# EAGLE board DM01eco (EAGLE 6.6.0), part 1 of 8
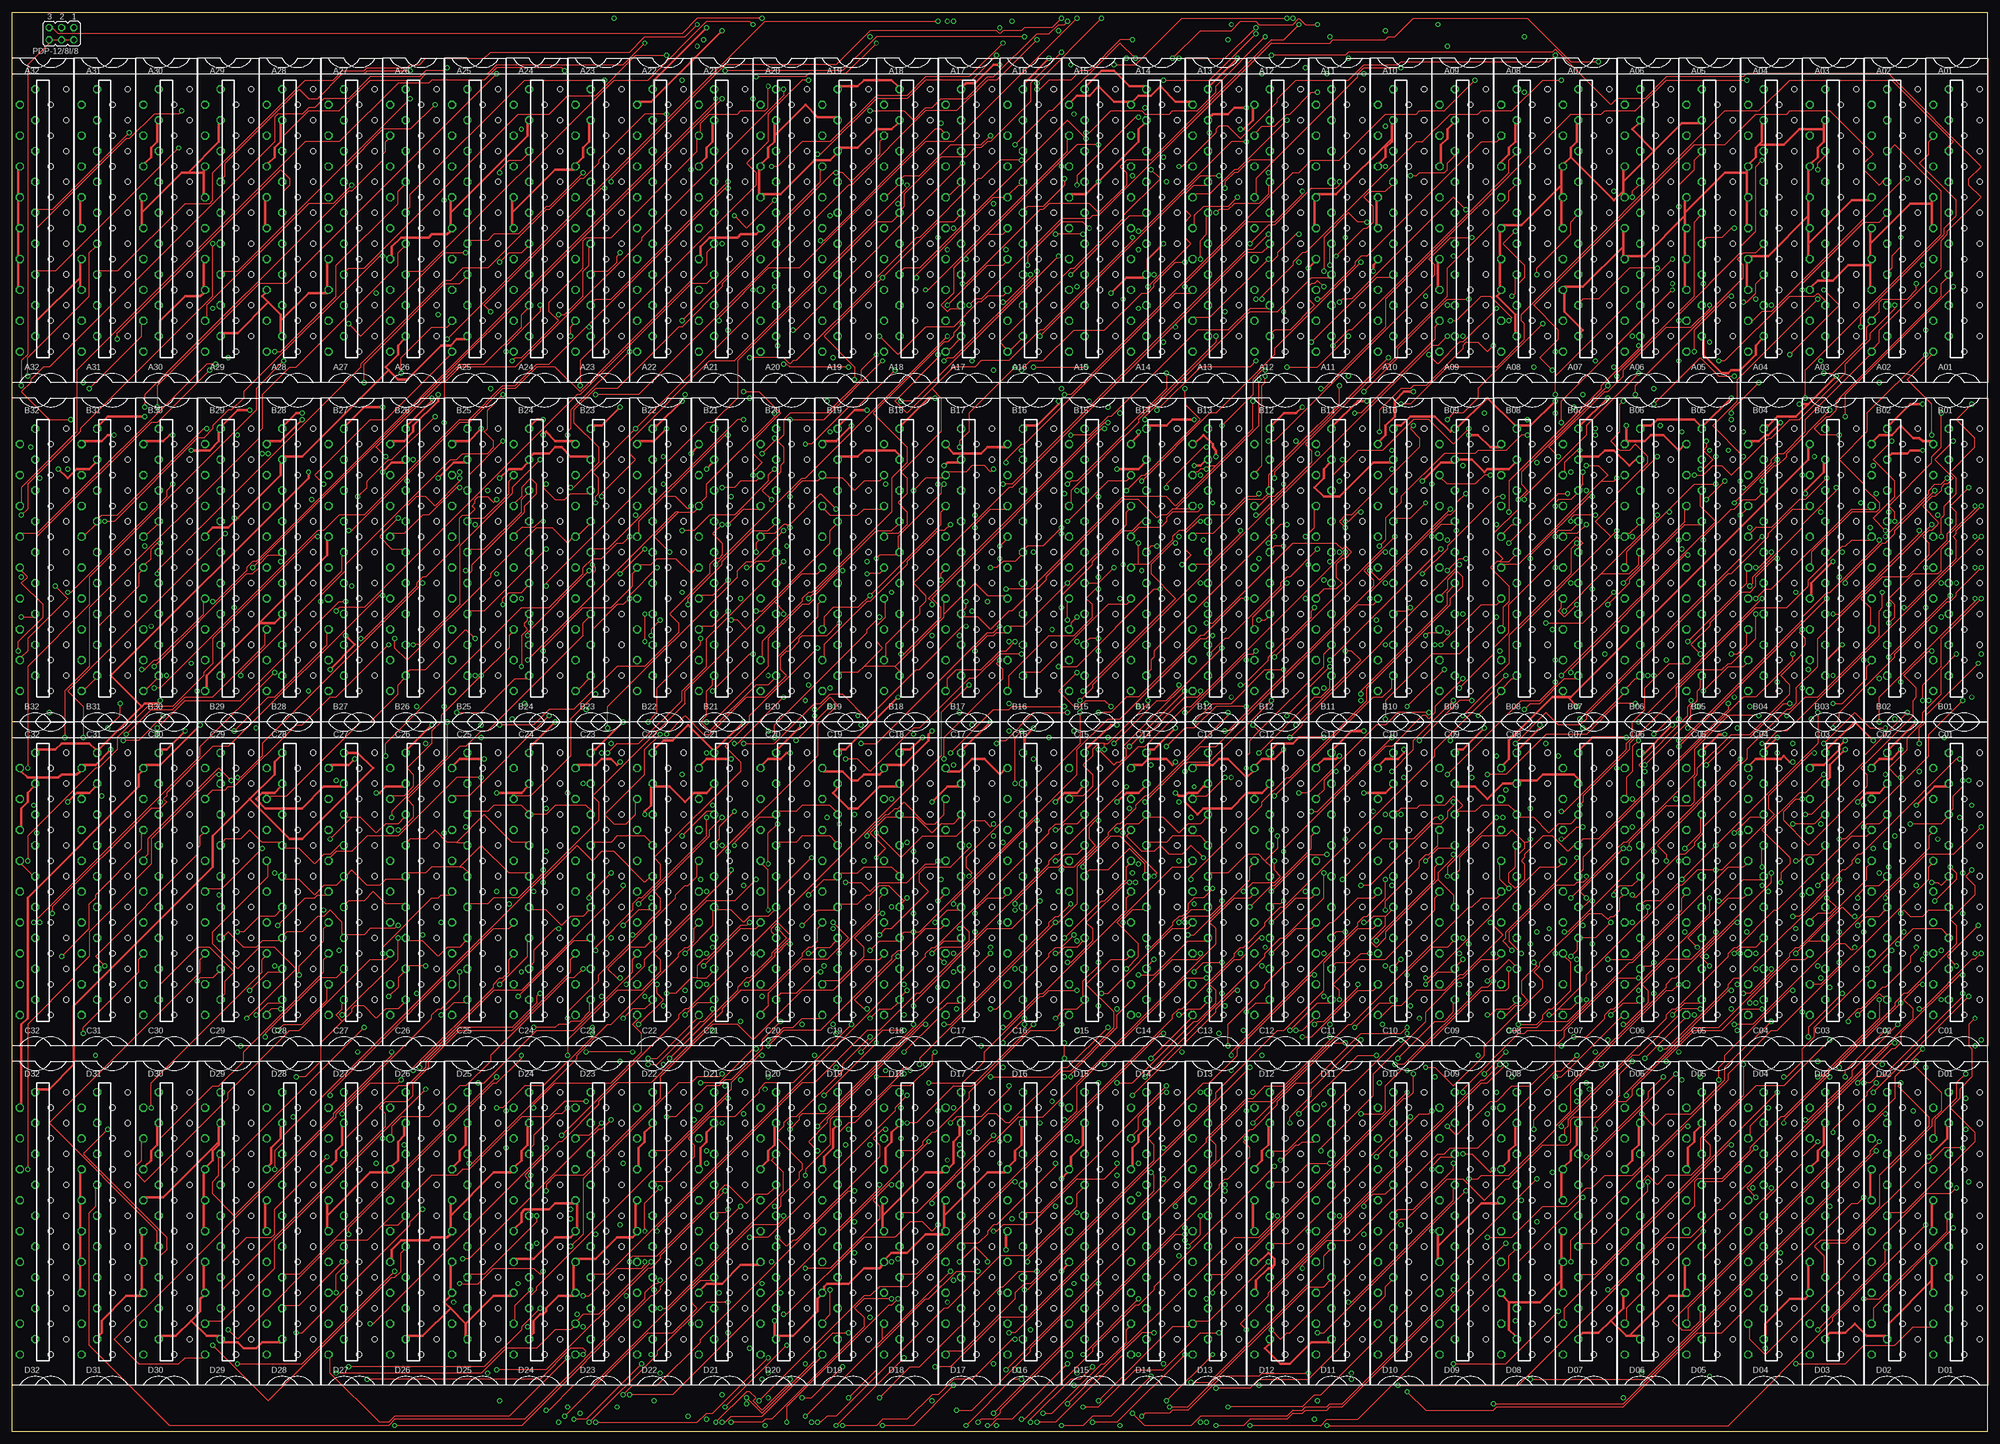
[diagram p6: board, top side]
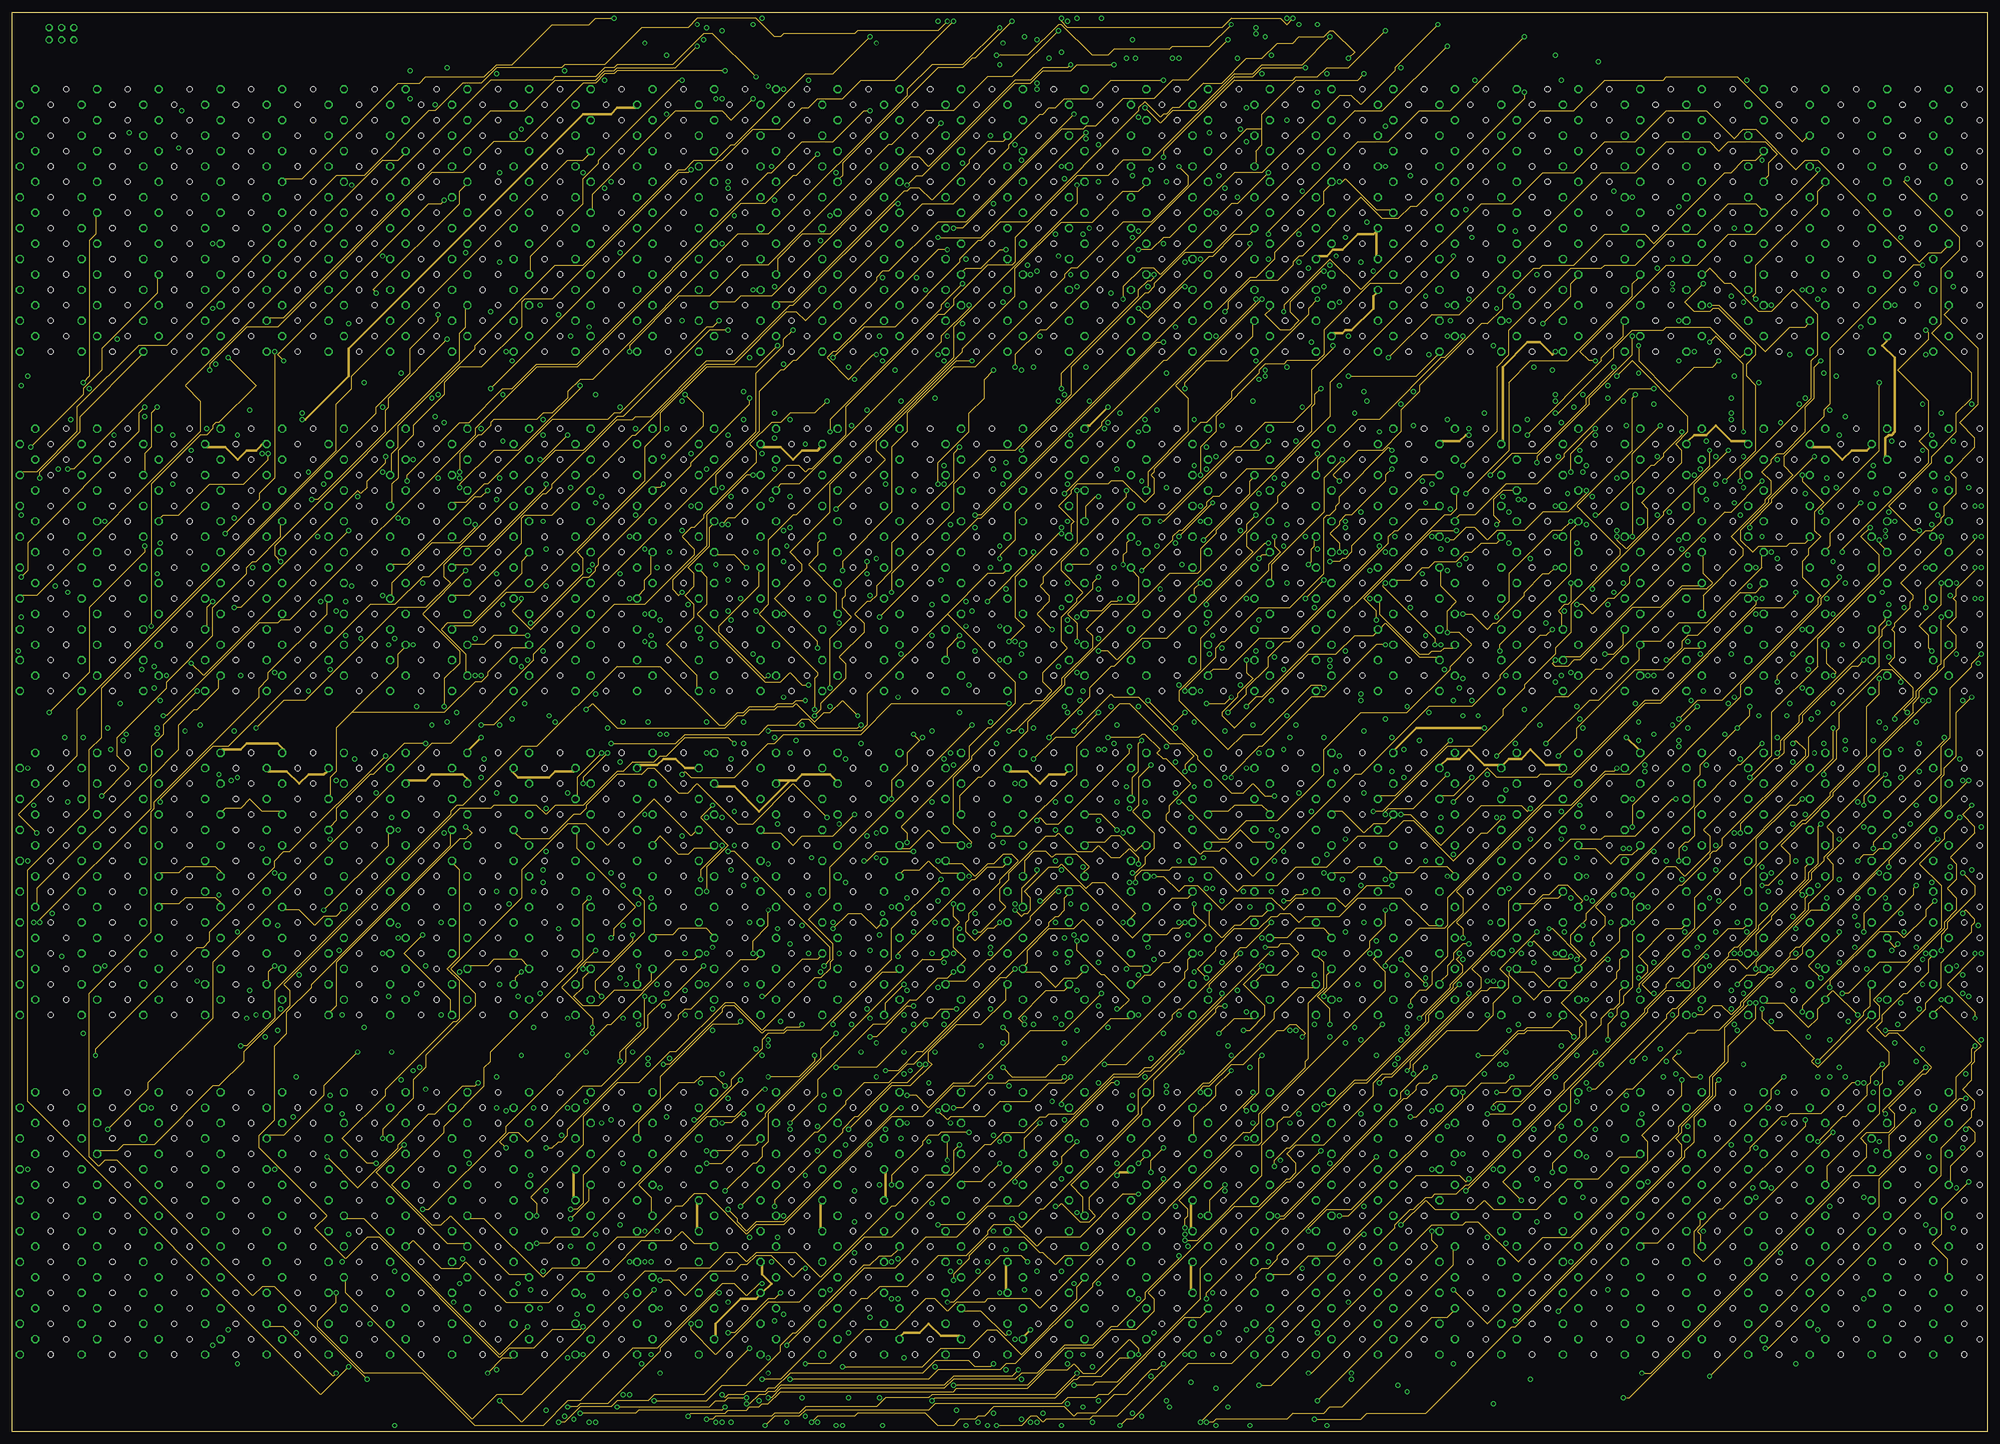
[diagram p7: board, inner layer Route2]
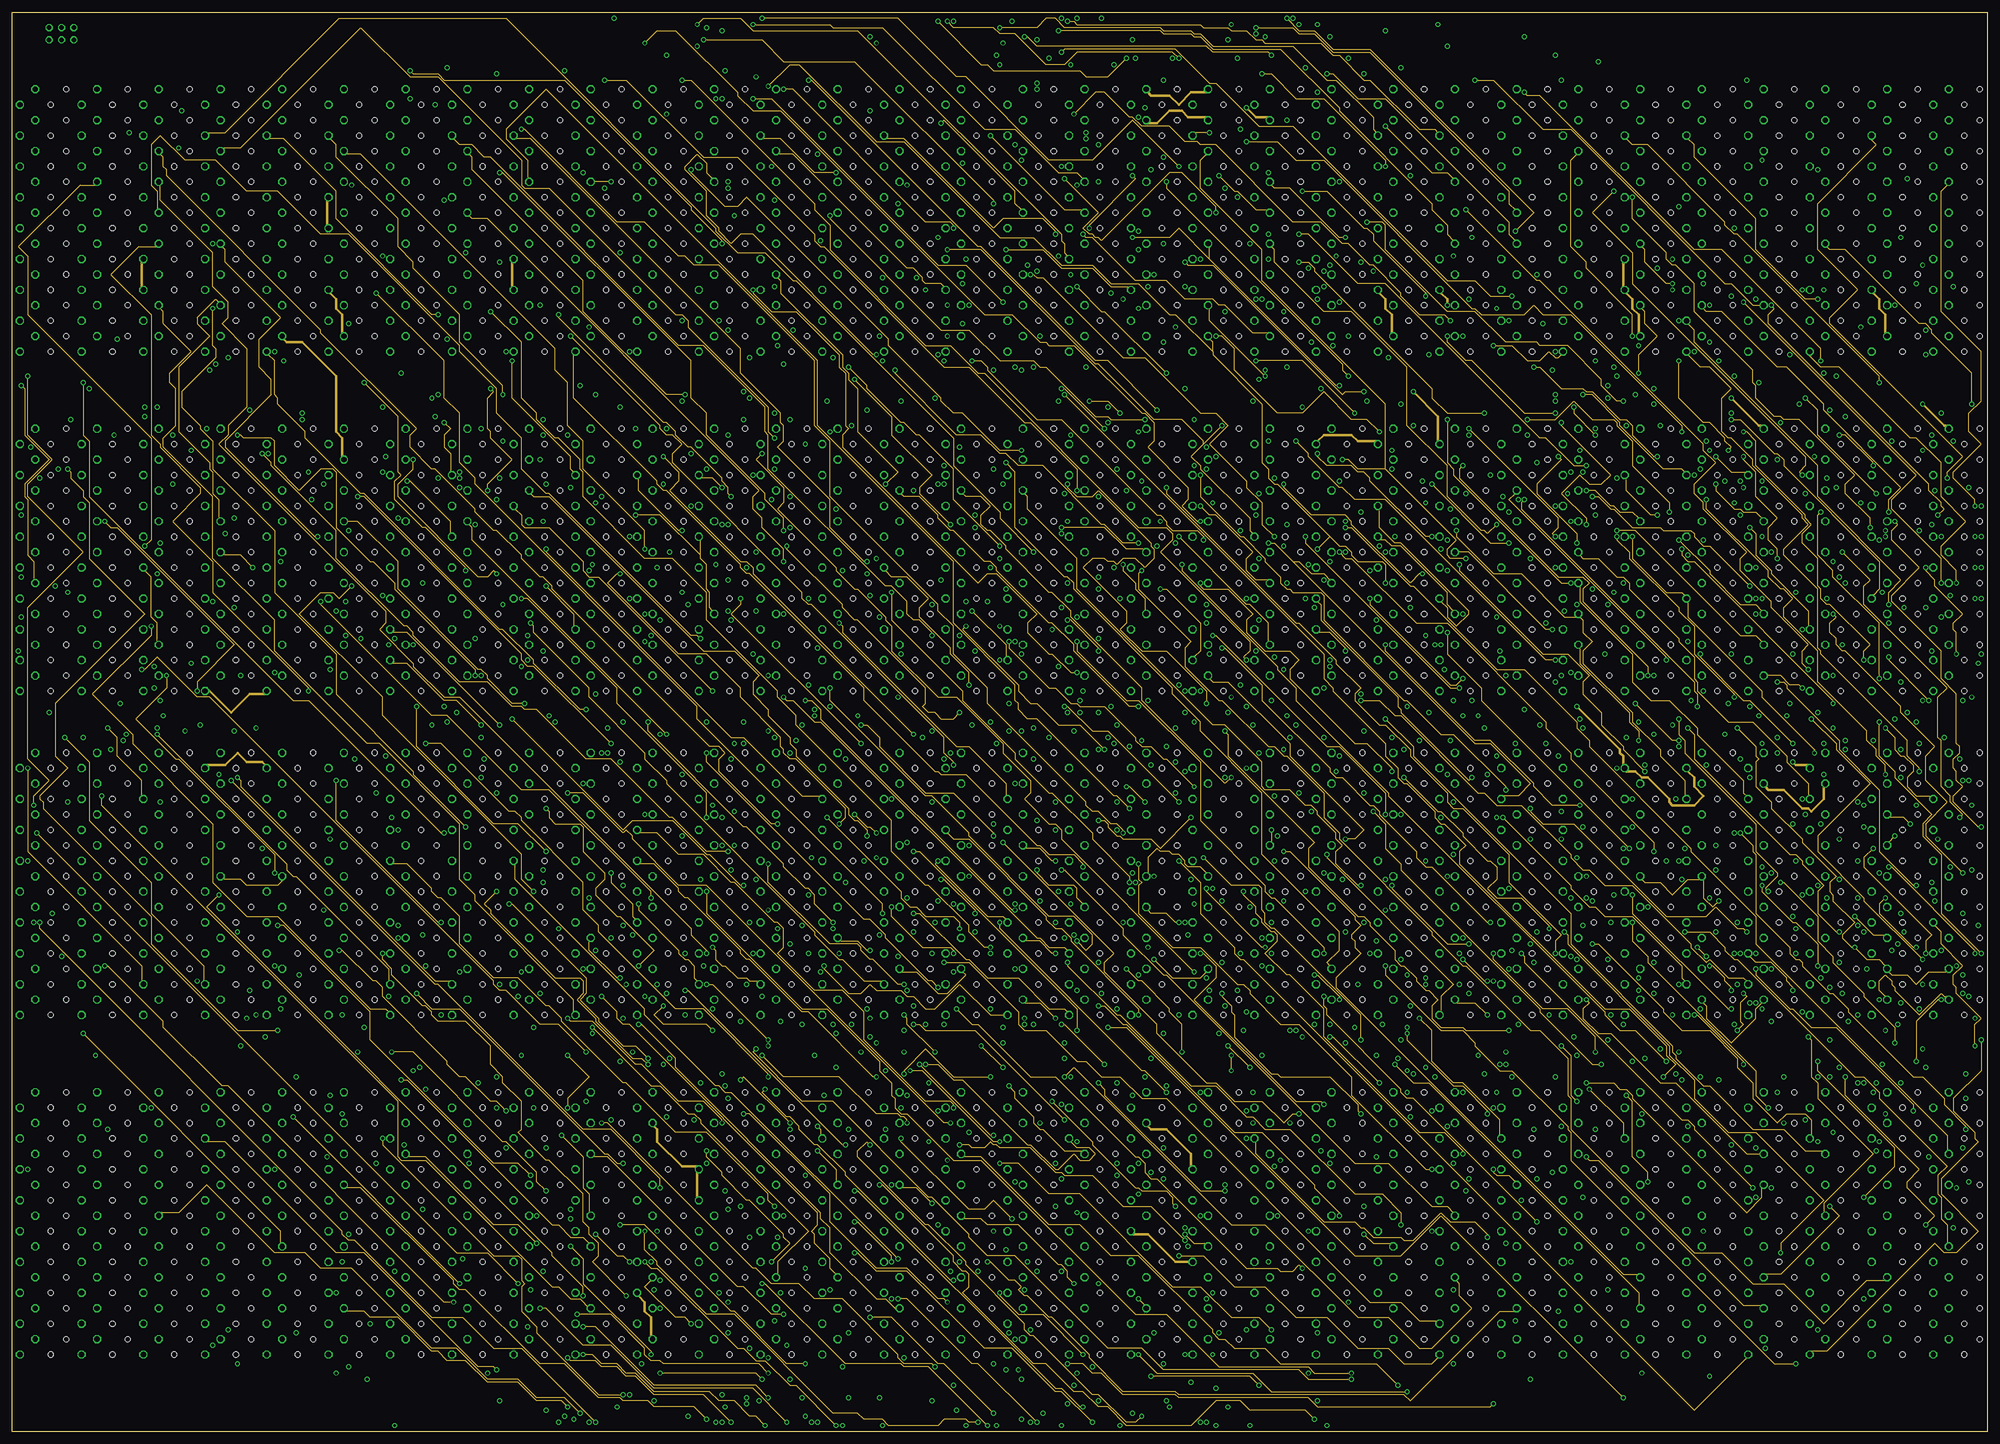
[diagram p8: board, inner layer Route15]
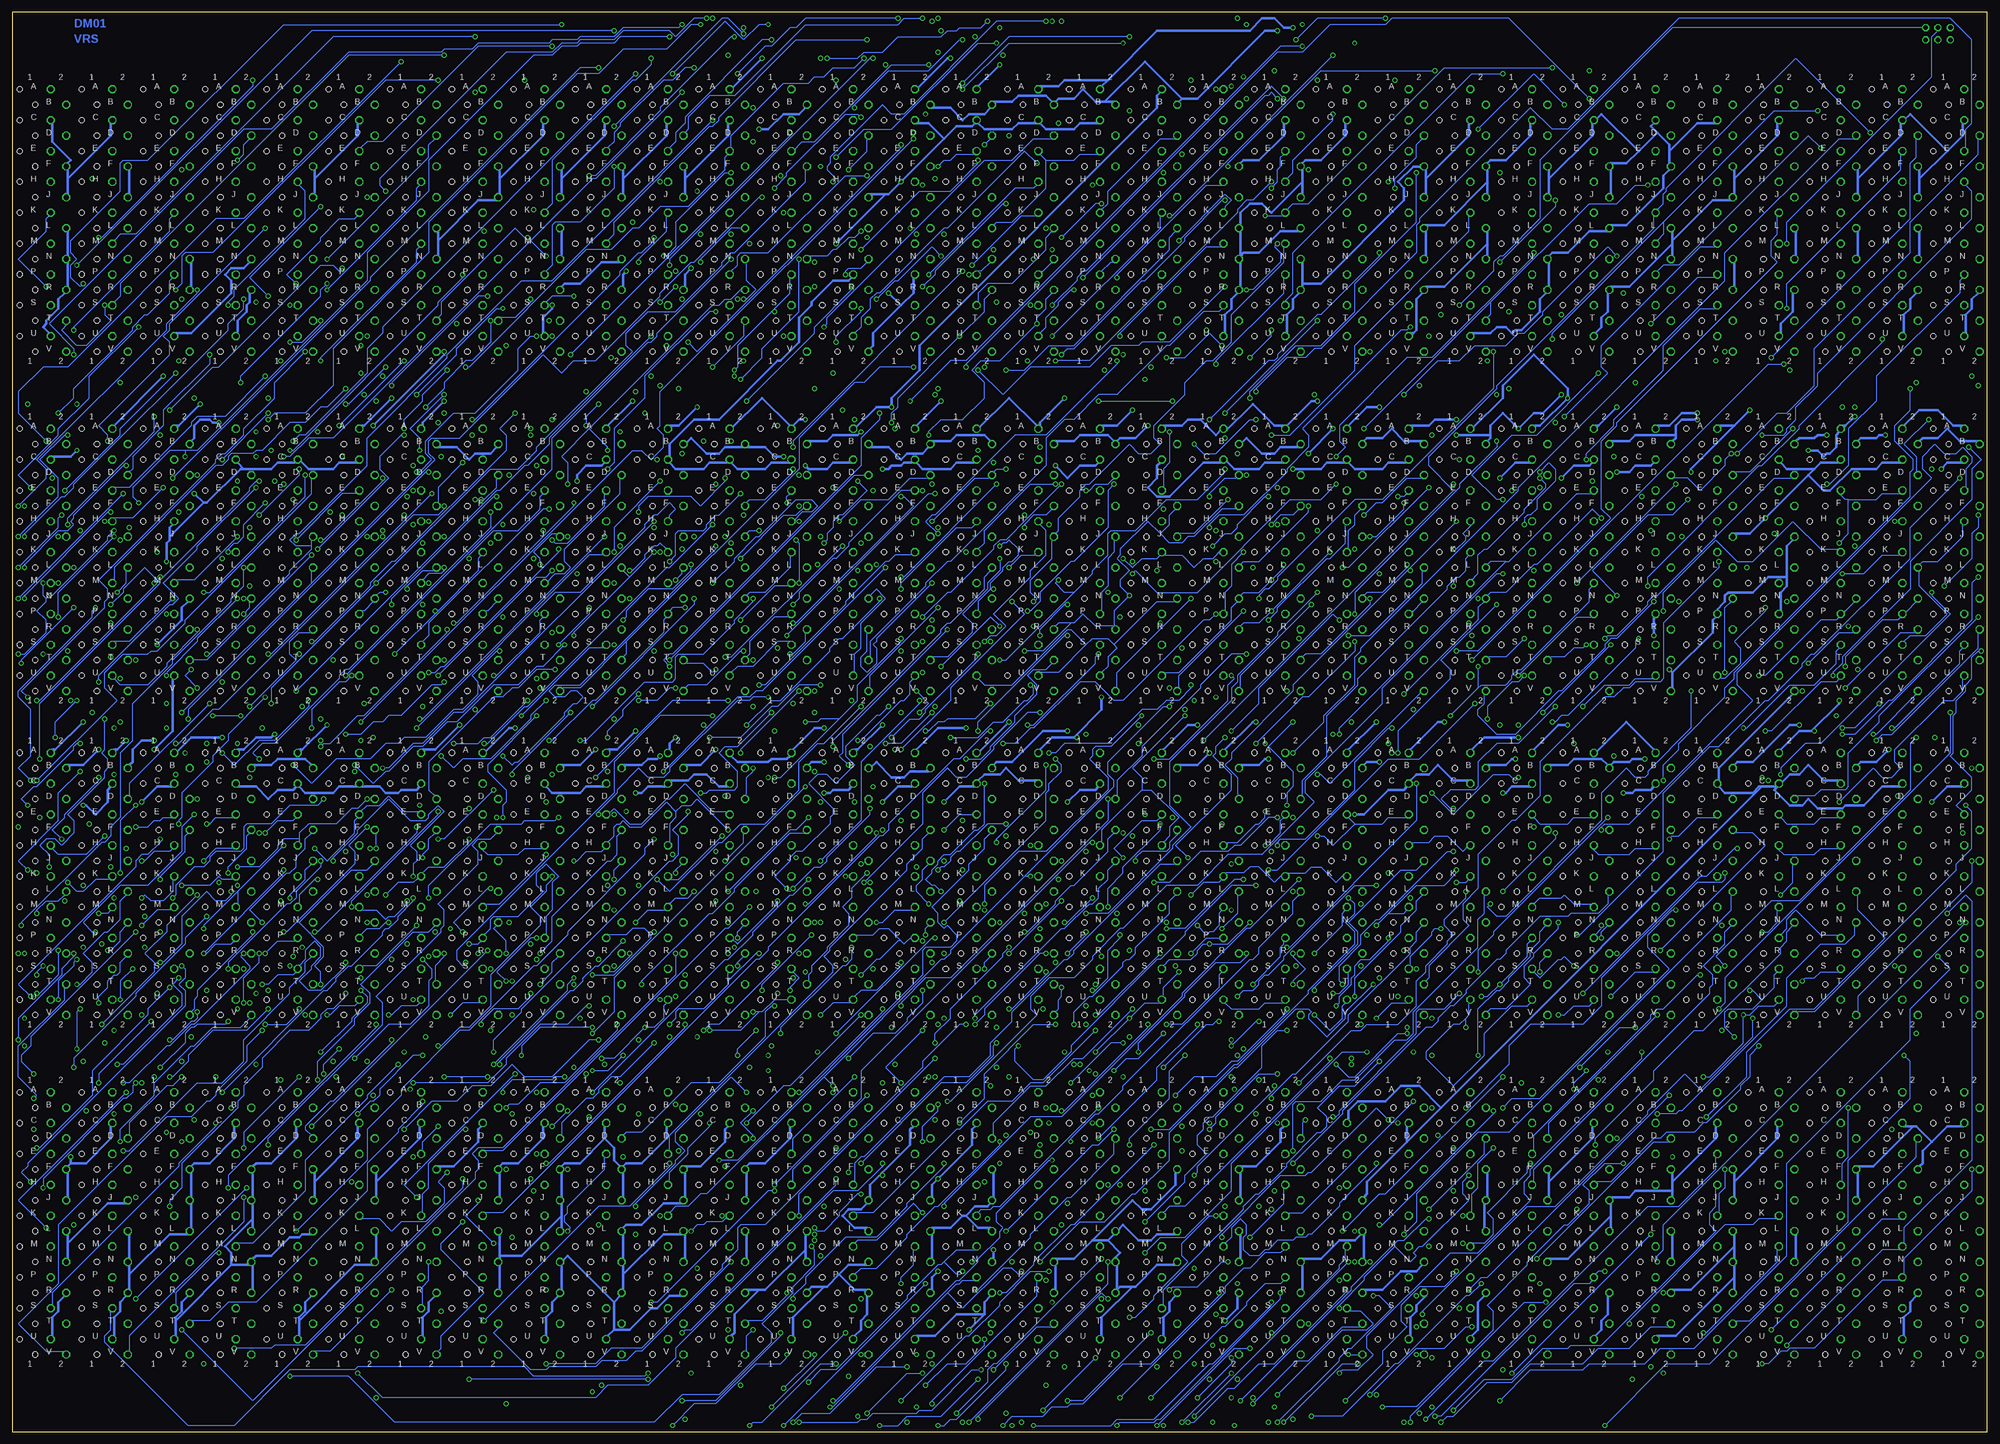
[diagram p9: board, bottom side, seen from below]

Size 406.4 x 292.1 mm. Coordinates in mm from the lower left corner, seen from the top.
Outline: 0,0 0,292.1 406.4,292.1 406.4,0 0,0
Copper layers (1*2*15*16): Top 0.035mm / dielectric 1.5mm / Route2 0.035mm / dielectric 0.15mm / Route15 0.035mm / dielectric 0.2mm / Bottom 0.035mm
Design rules "sierraproto": minimum track width 6mil, minimum drill 24mil, track to track 6mil, track to pad 6mil, pad to pad 10mil, via to via 6mil, smd to smd 6mil, copper to edge 25mil, drill to drill 10mil, minimum pad ring 10mil, minimum via ring 8mil, stop-mask expansion 0mil, vias tented up to drill 0mil, thermal gap 10mil
Net classes: 1 Supply: width 0.508 mm

## Footprints (pad centres in the part's own frame; a part is rotated, then mirrored left to right if it is on the bottom)
H807S = drill 1.092 octagon: A2 -1.587,28.575; B2 -4.763,25.4; C2 -1.587,22.225; D2 -4.763,19.05; E2 -1.587,15.875; F2 -4.763,12.7; H2 -1.587,9.525; J2 -4.763,6.35; K2 -1.587,3.175; L2 -4.763,0; M2 -1.587,-3.175; N2 -4.763,-6.35; P2 -1.587,-9.525; R2 -4.763,-12.7; S2 -1.587,-15.875; T2 -4.763,-19.05; U2 -1.587,-22.225; V2 -4.763,-25.4 | hole 1.092: 4.763,28.575; 1.587,25.4; 4.763,22.225; 1.587,19.05; 4.763,15.875; 1.587,12.7; 4.763,9.525; 1.587,6.35; 4.763,3.175; 1.587,0; 4.763,-3.175; 1.587,-6.35; 4.763,-9.525; 1.587,-12.7; 4.763,-15.875; 1.587,-19.05; 4.763,-22.225; 1.587,-25.4
JP3Q = drill 0.914 octagon: 1 -2.54,-1.27; 2 -2.54,1.27; 3 0,-1.27; 4 0,1.27; 5 2.54,-1.27; 6 2.54,1.27

## Placement (x,y rotation side)
A01  W021S  [H807S]  400.05,247.65 0 top
A02  W021S  [H807S]  387.35,247.65 0 top
A03  W021S  [H807S]  374.65,247.65 0 top
A04  W021S  [H807S]  361.95,247.65 0 top
A05  W021S  [H807S]  349.25,247.65 0 top
A06  W021S  [H807S]  336.55,247.65 0 top
A07  W021S  [H807S]  323.85,247.65 0 top
A08  W021S  [H807S]  311.15,247.65 0 top
A09  W021S  [H807S]  298.45,247.65 0 top
A10  W021S  [H807S]  285.75,247.65 0 top
A11  W021S  [H807S]  273.05,247.65 0 top
A12  S107S  [H807S]  260.35,247.65 0 top
A13  S107S  [H807S]  247.65,247.65 0 top
A14  W640S  [H807S]  234.95,247.65 0 top
A15  W640S  [H807S]  222.25,247.65 0 top
A16  S111S  [H807S]  209.55,247.65 0 top
A17  S111S  [H807S]  196.85,247.65 0 top
A18  S111S  [H807S]  184.15,247.65 0 top
A19  R202S  [H807S]  171.45,247.65 0 top
A20  W021S  [H807S]  158.75,247.65 0 top
A21  W021S  [H807S]  146.05,247.65 0 top
A22  EMPTYS  [H807S]  133.35,247.65 0 top
A23  W021S  [H807S]  120.65,247.65 0 top
A24  W021S  [H807S]  107.95,247.65 0 top
A25  W021S  [H807S]  95.25,247.65 0 top
A26  W021S  [H807S]  82.55,247.65 0 top
A27  W021S  [H807S]  69.85,247.65 0 top
A28  W021S  [H807S]  57.15,247.65 0 top
A29  W021S  [H807S]  44.45,247.65 0 top
A30  W021S  [H807S]  31.75,247.65 0 top
A31  W021S  [H807S]  19.05,247.65 0 top
A32  W021S  [H807S]  6.35,247.65 0 top
B01  EMPTYS  [H807S]  400.05,177.8 0 top
B02  R107S  [H807S]  387.35,177.8 0 top
B03  R603S  [H807S]  374.65,177.8 0 top
B04  S107S  [H807S]  361.95,177.8 0 top
B05  S107S  [H807S]  349.25,177.8 0 top
B06  S111S  [H807S]  336.55,177.8 0 top
B07  S107S  [H807S]  323.85,177.8 0 top
B08  S111S  [H807S]  311.15,177.8 0 top
B09  W005S  [H807S]  298.45,177.8 0 top
B10  S107S  [H807S]  285.75,177.8 0 top
B11  W005S  [H807S]  273.05,177.8 0 top
B12  S181S  [H807S]  260.35,177.8 0 top
B13  R107S  [H807S]  247.65,177.8 0 top
B14  S202S  [H807S]  234.95,177.8 0 top
B15  S107S  [H807S]  222.25,177.8 0 top
B16  S202S  [H807S]  209.55,177.8 0 top
B17  S202S  [H807S]  196.85,177.8 0 top
B18  S202S  [H807S]  184.15,177.8 0 top
B19  S202S  [H807S]  171.45,177.8 0 top
B20  S202S  [H807S]  158.75,177.8 0 top
B21  S202S  [H807S]  146.05,177.8 0 top
B22  R002S  [H807S]  133.35,177.8 0 top
B23  S111S  [H807S]  120.65,177.8 0 top
B24  W005S  [H807S]  107.95,177.8 0 top
B25  S107S  [H807S]  95.25,177.8 0 top
B26  S107S  [H807S]  82.55,177.8 0 top
B27  W640S  [H807S]  69.85,177.8 0 top
B28  W640S  [H807S]  57.15,177.8 0 top
B29  W640S  [H807S]  44.45,177.8 0 top
B30  S111S  [H807S]  31.75,177.8 0 top
B31  S111S  [H807S]  19.05,177.8 0 top
B32  S107S  [H807S]  6.35,177.8 0 top
C01  B141S  [H807S]  400.05,111.12 0 top
C02  B141S  [H807S]  387.35,111.12 0 top
C03  B141S  [H807S]  374.65,111.12 0 top
C04  B141S  [H807S]  361.95,111.12 0 top
C05  B141S  [H807S]  349.25,111.12 0 top
C06  B141S  [H807S]  336.55,111.12 0 top
C07  B141S  [H807S]  323.85,111.12 0 top
C08  B141S  [H807S]  311.15,111.12 0 top
C09  B141S  [H807S]  298.45,111.12 0 top
C10  B141S  [H807S]  285.75,111.12 0 top
C11  B141S  [H807S]  273.05,111.12 0 top
C12  B141S  [H807S]  260.35,111.12 0 top
C13  B141S  [H807S]  247.65,111.12 0 top
C14  B141S  [H807S]  234.95,111.12 0 top
C15  B141S  [H807S]  222.25,111.12 0 top
C16  B141S  [H807S]  209.55,111.12 0 top
C17  B141S  [H807S]  196.85,111.12 0 top
C18  B141S  [H807S]  184.15,111.12 0 top
C19  B141S  [H807S]  171.45,111.12 0 top
C20  B141S  [H807S]  158.75,111.12 0 top
C21  B141S  [H807S]  146.05,111.12 0 top
C22  B141S  [H807S]  133.35,111.12 0 top
C23  B141S  [H807S]  120.65,111.12 0 top
C24  B141S  [H807S]  107.95,111.12 0 top
C25  B141S  [H807S]  95.25,111.12 0 top
C26  B141S  [H807S]  82.55,111.12 0 top
C27  B141S  [H807S]  69.85,111.12 0 top
C28  B141S  [H807S]  57.15,111.12 0 top
C29  B141S  [H807S]  44.45,111.12 0 top
C30  B141S  [H807S]  31.75,111.12 0 top
C31  EMPTYS  [H807S]  19.05,111.12 0 top
C32  R302S  [H807S]  6.35,111.12 0 top
D01  W021S  [H807S]  400.05,41.27 0 top
D02  W021S  [H807S]  387.35,41.27 0 top
D03  W021S  [H807S]  374.65,41.27 0 top
D04  W021S  [H807S]  361.95,41.27 0 top
D05  W021S  [H807S]  349.25,41.27 0 top
D06  W021S  [H807S]  336.55,41.27 0 top
D07  W021S  [H807S]  323.85,41.27 0 top
D08  W021S  [H807S]  311.15,41.27 0 top
D09  W021S  [H807S]  298.45,41.27 0 top
D10  W021S  [H807S]  285.75,41.27 0 top
D11  W021S  [H807S]  273.05,41.27 0 top
D12  W021S  [H807S]  260.35,41.27 0 top
D13  W021S  [H807S]  247.65,41.27 0 top
D14  W021S  [H807S]  234.95,41.27 0 top
D15  W021S  [H807S]  222.25,41.27 0 top
D16  W021S  [H807S]  209.55,41.27 0 top
D17  W021S  [H807S]  196.85,41.27 0 top
D18  W021S  [H807S]  184.15,41.27 0 top
D19  W021S  [H807S]  171.45,41.27 0 top
D20  W021S  [H807S]  158.75,41.27 0 top
D21  W021S  [H807S]  146.05,41.27 0 top
D22  W021S  [H807S]  133.35,41.27 0 top
D23  W021S  [H807S]  120.65,41.27 0 top
D24  W021S  [H807S]  107.95,41.27 0 top
D25  W021S  [H807S]  95.25,41.27 0 top
D26  W021S  [H807S]  82.55,41.27 0 top
D27  W021S  [H807S]  69.85,41.27 0 top
D28  W021S  [H807S]  57.15,41.27 0 top
D29  W021S  [H807S]  44.45,41.27 0 top
D30  W021S  [H807S]  31.75,41.27 0 top
D31  W021S  [H807S]  19.05,41.27 0 top
D32  EMPTYS  [H807S]  6.35,41.27 0 top
PDP-12/8I/8  [JP3Q]  10.16,287.65 180 top
U$1  [CBLOCK]  0,9.53 0 top
U$2  [CBLOCK]  50.8,9.53 0 top
U$3  [CBLOCK]  101.6,9.53 0 top
U$4  [CBLOCK]  152.4,9.53 0 top
U$5  [CBLOCK]  203.2,9.53 0 top
U$6  [CBLOCK]  254,9.53 0 top
U$7  [CBLOCK]  304.8,9.53 0 top
U$8  [CBLOCK]  355.6,9.53 0 top
U$9  [CBLOCK]  0,146.05 0 top
U$10  [CBLOCK]  50.8,146.05 0 top
U$11  [CBLOCK]  101.6,146.05 0 top
U$12  [CBLOCK]  152.4,146.05 0 top
U$13  [CBLOCK]  203.2,146.05 0 top
U$14  [CBLOCK]  254,146.05 0 top
U$15  [CBLOCK]  304.8,146.05 0 top
U$16  [CBLOCK]  355.6,146.05 0 top

## Tracks (layer width: path | path; a pad name or v marks a point on that pad's centre or on a via)
1-CA_INH  (via drill 0.61)
  Top 0.152: v153.03,278.76 163.19,278.76 163.83,279.4 171.45,279.4 v177.8,285.75 | v210.82,276.22 211.46,276.22 213.36,278.13 217.81,278.13 219.71,280.03 221.62,280.03 227.97,286.38 v230.5,286.38
  Route2 0.152: v153.03,278.76 144.15,287.65 142.24,287.65 135.89,281.3 124.46,281.3 123.83,280.67 121.92,280.67 120.02,278.76 111.76,278.76 111.12,278.13 98.42,278.13 35.56,215.27 38.73,212.09 38.73,205.74 5.08,172.09 1.91,172.09 B32.N2
  Bottom 0.152: v177.8,285.75 201.29,285.75 v210.82,276.22 | v230.5,286.38 245.11,286.38 260.99,270.51 260.99,269.88 262.25,268.6 262.89,268.6 282.57,248.92 282.57,246.38 283.85,245.11 A10.M2
1-CA_INH0  (via drill 0.61)
  Top 0.152: v207.65,10.79 205.74,10.79 v196.22,1.27 | v147.32,26.67 142.88,26.67 132.72,16.51 132.72,15.88 v118.75,1.91 | v19.05,95.89 17.14,97.79 38.1,118.75 38.1,120.02 38.73,120.65 38.73,122.56 39.37,123.19 C29.F2
  Route2 0.152: v278.13,40.64 277.5,40.64 250.82,13.97 241.94,13.97 230.5,2.54 229.24,2.54 v227.97,1.27
  Route15 0.152: v278.13,40.64 280.04,38.73 283.85,38.73 D10.M2 | v90.81,26.67 88.9,26.67 44.45,71.12 43.18,71.12 31.11,83.19 31.11,84.46 19.68,95.89 v19.05,95.89
  Bottom 0.152: v227.97,1.27 224.16,1.27 222.25,3.18 215.26,3.18 v207.65,10.79 | v196.22,1.27 180.34,1.27 179.07,2.54 171.45,2.54 160.02,13.97 159.38,13.97 147.32,26.04 v147.32,26.67 | v118.75,1.91 118.75,3.18 95.25,26.67 v90.81,26.67
1-CA_INH1  (via drill 0.61)
  Top 0.152: v117.47,27.94 118.75,27.94 124.46,33.66 129.54,33.66 130.18,34.29 v130.18,34.92 | v169.54,1.27 v183.51,15.24 | v194.31,4.45 197.49,4.45 209.55,16.51 209.55,17.14 222.88,30.48 v223.52,30.48
  Route15 0.152: v42.55,110.49 40.01,107.95 111.12,36.83 111.12,36.2 117.47,29.84 v117.47,27.94 | v130.18,34.92 131.44,33.66 132.72,33.66 149.22,17.14 150.5,17.14 153.03,14.61 154.94,14.61 160.02,9.53 161.29,9.53 v169.54,1.27
  Bottom 0.152: v42.55,110.49 40.01,113.03 40.01,116.84 C29.J2 | v183.51,15.24 v194.31,4.45 | v223.52,30.48 223.52,31.75 220.98,34.29 220.98,37.47 D15.M2
1-CA_INH2  (via drill 0.61)
  Top 0.152: v51.44,120.02 43.18,111.76 40.01,111.76 C29.L2
  Route15 0.152: v83.19,90.17 86.36,87 92.08,87 121.92,57.15 122.56,57.15 124.46,55.24 v125.73,55.24
  Bottom 0.152: v51.44,120.02 52.07,120.02 57.78,114.3 59.05,114.3 v83.19,90.17 | v125.73,55.24 125.73,54.61 133.35,46.99 133.35,46.35 139.06,40.64 139.7,40.64 140.34,40.01 142.24,40.01 142.88,39.37 146.05,39.37 147.96,37.47 148.59,37.47 149.86,36.2 151.76,36.2 153.03,37.47 153.03,40.01 152.4,40.64 152.4,42.55 153.67,43.81 155.57,41.91 155.57,40.01 156.84,38.73 D20.M2
1-CA_INH3  (via drill 0.61)
  Route2 0.152: v80.64,59.05 74.93,53.34 89.53,38.73 93.34,38.73 D25.M2
  Bottom 0.152: v80.64,59.05 80.64,60.32 68.58,72.39 68.58,74.3 60.33,82.55 58.42,82.55 42.55,98.43 42.55,99.7 41.27,100.97 41.27,102.87 40.01,104.14 C29.N2
1-CA_INH4
  Top 0.152: D30.M2 29.84,38.73 29.84,41.27 7.62,63.5 38.73,94.62 38.73,97.16 39.37,97.79 C29.R2
1-CA_INH5  (via drill 0.61)
  Top 0.152: v10.79,142.88 10.79,152.4 15.88,157.48 15.88,169.55 50.8,204.47 50.8,205.74 51.44,206.38 51.44,213.36 57.15,219.08 58.42,219.08 79.38,240.03 79.38,242.57 80.64,243.84 A26.M2
  Route15 0.152: v10.79,142.88 15.88,137.8 15.88,125.73 28.57,113.03 28.57,106.68 39.37,95.89 39.37,92.71 C29.T2
1-CA_INH6  (via drill 0.61)
  Top 0.152: v3.17,217.17 3.17,220.98 15.88,233.68 15.88,242.57 17.14,243.84 A31.M2
  Route15 0.152: v4.45,128.91 4.45,130.81 7.62,133.98 3.17,138.43 3.17,169.55 14.61,180.97 3.17,192.41 3.17,194.94 8.26,200.03 3.17,205.11 v3.17,217.17
  Bottom 0.152: v4.45,128.91 3.17,127.64 3.17,120.02 6.35,116.84 6.35,115.57 35.56,86.36 39.37,86.36 C29.V2
!-BMB3  (via drill 0.61)
  Top 0.152: v369.57,81.28 369.57,83.19 v376.56,90.17
  Route2 0.152: v376.56,90.17 377.82,90.17 384.18,96.52 389.89,96.52 396.88,103.51 396.88,112.4 392.43,116.84 397.51,121.92 397.51,123.19 v400.69,126.37 | v376.56,180.97 376.56,181.61 394.33,199.39 394.33,201.93 392.43,203.84 394.33,205.74 394.33,212.09 387.99,218.44 394.33,224.79 394.33,226.06 v393.7,226.69
  Route15 0.152: v369.57,81.28 370.2,80.65 370.2,73.03 371.48,71.75 371.48,68.58 382.9,57.15 372.75,46.99 372.75,45.09 D03.K2 | v400.69,126.37 401.32,127 398.78,129.54 398.78,130.81 396.88,132.72 396.88,142.24 396.24,142.88 396.24,151.13 398.14,153.03 381,170.18 381,173.99 382.27,175.26 v376.56,180.97
  Bottom 0.152: v393.7,226.69 393.7,227.33 374.01,247.02 374.01,249.56 373.38,250.19 A03.K2
!-BMB4  (via drill 0.61)
  Top 0.152: v388.62,71.75 387.99,71.12 394.33,64.77 394.33,62.87 384.18,52.7 384.18,46.35 377.19,39.37 372.11,39.37 370.84,38.1 372.75,36.2 372.75,32.38 D03.P2 | v377.82,84.46 377.82,85.09 379.73,87 380.37,87 384.81,91.44 385.44,91.44 390.52,96.52 390.52,97.79 391.8,99.06 v391.8,99.7 | v385.44,109.86 385.44,110.49 393.7,118.75 399.42,118.75 v405.13,124.46 | v387.35,187.33 387.35,189.23 386.08,190.5 394.97,199.39 394.97,200.66 396.88,202.56 v396.88,209.55
  Route15 0.152: v391.8,99.7 391.16,99.7 384.18,106.68 384.18,108.59 v385.44,109.86 | v405.13,124.46 404.5,124.46 399.42,129.54 399.42,130.81 401.32,132.72 400.05,133.98 400.05,135.89 399.42,136.53 399.42,138.43 400.69,139.7 400.69,140.97 400.05,141.61 400.05,151.77 396.88,154.94 396.88,160.66 386.71,170.81 386.71,172.09 392.43,177.8 386.71,183.52 386.71,185.42 387.99,186.69 v387.35,187.33
  Bottom 0.152: v388.62,71.75 388.62,73.66 v377.82,84.46 | v396.88,209.55 393.7,212.72 393.7,214.63 381.63,226.69 381.63,227.33 379.1,229.87 378.46,229.87 374.01,234.31 374.01,236.86 373.38,237.49 A03.P2
!-BMB5  (via drill 0.61)
  Top 0.152: v295.27,114.3 295.27,116.21 v305.44,126.37 | v298.45,147.32 304.8,153.67 304.8,154.94 307.98,158.12 307.98,163.83 320.68,176.53 320.68,181.61 v321.94,182.88 | v318.13,200.66 316.23,202.56 327.66,214 328.3,214 331.47,217.17 331.47,218.44 340.36,227.33 345.44,227.33 349.25,231.14 v349.25,231.78
  Route2 0.152: v349.25,231.78 351.15,231.78 360.68,222.25 365.76,227.33 368.94,227.33 369.57,227.97 A03.T2
  Route15 0.152: v321.94,67.95 320.68,69.22 320.68,77.47 v318.77,79.38 | v321.94,182.88 321.94,184.78 313.69,193.04 313.69,194.94 318.77,200.03 v318.13,200.66
  Bottom 0.152: v321.94,67.95 321.94,67.31 327.02,62.23 327.02,61.59 333.38,55.24 333.38,49.53 356.24,26.67 361.95,26.67 365.76,22.86 369.57,22.86 D03.T2 | v318.77,79.38 318.13,79.38 314.32,83.19 312.42,83.19 307.98,87.63 307.98,93.98 297.81,104.14 297.81,106.05 299.72,107.95 296.55,111.12 296.55,112.4 295.27,113.67 v295.27,114.3 | v305.44,126.37 305.44,128.91 304.8,129.54 304.8,132.08 308.61,135.89 308.61,137.16 v298.45,147.32
!-BMB6  (via drill 0.61)
  Top 0.152: v361.31,66.67 357.5,62.87 357.5,60.96 D04.D2 | v342.9,228.6 342.9,229.87 355.6,242.57 355.6,243.84 358.77,247.02 358.77,260.35 v360.05,261.62
  Route2 0.152: v333.38,104.78 333.38,109.22 340.36,116.21 342.26,116.21 344.17,114.3 349.25,119.38 349.25,122.56 347.98,123.83 362.58,138.43 363.22,138.43 364.49,139.7 364.49,142.24 368.3,146.05 368.3,147.32 378.46,157.48 379.73,157.48 v381,158.75 | v356.24,205.74 356.24,219.71 350.52,225.43 v349.25,224.16
  Route15 0.152: v361.31,66.67 358.77,69.22 358.77,74.3 336.55,96.52 336.55,97.79 333.38,100.97 v333.38,104.78 | v381,158.75 381,160.66 382.27,161.93 374.01,170.18 373.38,170.18 372.11,171.45 372.11,173.36 371.48,173.99 371.48,179.71 368.3,182.88 368.3,184.78 370.2,186.69 368.94,187.96 368.94,188.59 358.77,198.75 358.77,203.84 356.87,205.74 v356.24,205.74
  Bottom 0.152: v349.25,224.16 346.71,224.16 342.9,227.97 v342.9,228.6 | v360.05,261.62 358.77,262.89 358.77,264.8 357.5,266.06 A04.D2
!-BMB7  (via drill 0.61)
  Top 0.152: v274.32,187.33 274.95,187.33 276.86,189.23 v277.5,189.23 | v259.71,196.22 259.71,197.49 v283.21,220.98
  Route2 0.152: v287.65,87.63 287.65,88.9 289.56,90.81 290.83,90.81 292.1,92.08 292.1,94.62 295.27,97.79 295.27,103.51 298.45,106.68 298.45,109.86 297.18,111.12 314.96,128.91 320.68,128.91 327.66,135.89 329.56,135.89 v330.2,136.53 | v283.21,220.98 292.1,229.87 297.81,229.87 327.02,259.08 334.01,259.08 340.36,265.43 349.25,265.43 351.15,263.52 353.06,265.43 360.68,265.43 363.22,262.89 361.31,260.99 361.31,258.44 360.68,257.81 A04.H2
  Route15 0.152: v323.85,71.75 329.56,71.75 330.83,70.48 332.11,70.48 333.38,69.22 333.38,68.58 356.87,45.09 360.05,48.26 360.05,50.16 D04.H2
  Bottom 0.152: v323.85,71.75 308.61,71.75 304.8,75.57 304.8,76.84 297.81,83.82 292.1,83.82 288.29,87.63 v287.65,87.63 | v330.2,136.53 328.93,136.53 323.85,141.61 321.94,141.61 315.6,147.96 313.69,147.96 v274.32,187.33 | v277.5,189.23 277.5,190.5 275.59,192.41 266.7,192.41 264.8,190.5 259.71,195.58 v259.71,196.22
!-BMB8  (via drill 0.61)
  Top 0.152: v334.01,213.36 334.01,215.27 356.24,237.49 356.24,240.03 354.96,241.3 356.24,242.57 358.77,242.57 360.05,243.84 A04.M2
  Route2 0.152: v280.04,127.64 281.94,127.64 295.27,140.97 300.36,140.97 306.7,147.32 306.7,148.59 311.15,153.03 311.15,153.67 317.5,160.02 317.5,161.29 320.68,164.47 320.68,170.18 330.83,180.34 330.83,181.61 321.94,190.5 333.38,201.93 333.38,212.72 v334.01,213.36
  Route15 0.152: v327.02,75.57 325.12,75.57 314.32,86.36 314.32,87 285.75,115.57 285.75,116.84 282.57,120.02 282.57,125.09 v280.04,127.64
  Bottom 0.152: v327.02,75.57 333.38,69.22 333.38,68.58 346.07,55.88 346.07,49.53 356.87,38.73 360.05,38.73 D04.M2
!BREAK  (via drill 0.61)
  Top 0.152: v360.05,171.45 v334.64,146.05 | v220.98,266.06 217.17,269.88 186.69,239.4 183.51,239.4 182.88,238.76 A18.P2
  Route2 0.152: v374.65,155.58 375.29,156.21 373.38,158.12 373.38,161.29 B03.S2
  Bottom 0.152: v374.65,155.58 374.65,156.21 368.3,162.56 368.3,163.19 v360.05,171.45 | v334.64,146.05 278.76,201.93 276.86,201.93 274.95,200.03 272.42,202.56 272.42,205.11 273.69,206.38 273.05,207.01 273.05,214 v220.98,266.06 | A18.N2 179.71,240.66 180.34,240.66 182.25,238.76 A18.P2
!BRK_SYNC_CLK  (via drill 0.61)
  Top 0.152: v108.58,231.78 108.58,230.5 101.6,223.52 v101.6,222.25 | v174.62,141.61 177.8,141.61 200.66,164.47 201.93,164.47 v203.2,165.74 | v215.26,157.48 219.07,157.48 234.95,173.36 v236.22,173.36
  Route15 0.152: v149.86,171.45 149.86,170.18 147.96,168.28 v174.62,141.61 | v236.22,173.36 237.49,173.36 244.47,166.37 244.47,160.66 243.21,159.39 B13.T2
  Bottom 0.152: v108.58,231.78 101.6,238.76 101.6,240.66 100.33,241.94 99.69,241.94 92.08,249.56 92.08,261.62 64.77,288.92 13.34,288.92 PDP-12/8I/8.1 | v101.6,222.25 101.6,214.63 124.46,191.77 130.18,191.77 146.05,175.9 146.05,175.26 147.96,173.36 148.59,173.36 149.86,172.09 v149.86,171.45 | v203.2,165.74 205.1,167.64 v215.26,157.48
-15V  (via drill 0.61)
  Top 0.508: v146.05,288.29 131.44,273.69 128.91,273.69 A22.B2 | A15.B2 217.81,273.69 219.07,274.95 221.62,274.95 223.52,276.86 226.69,273.69 229.87,273.69 A14.B2 230.5,273.69 231.78,274.95 234.31,274.95 236.22,276.86 239.4,273.69 242.57,273.69 A13.B2 | v252.73,267.97 253.37,267.97 255.27,269.88 255.27,272.41 A12.B2 | v33.02,205.11 32.38,205.11 31.11,203.84 27.3,203.84 B30.B2 | v59.69,208.28 55.24,203.84 52.7,203.84 B28.B2 | v20.95,205.11 19.68,205.11 18.41,203.84 14.61,203.84 B31.B2 | v96.52,206.38 93.98,203.84 90.81,203.84 B25.B2 | v109.22,205.11 109.86,205.74 111.76,203.84 115.57,203.84 B23.B2 | v299.72,205.11 301.62,205.11 304.17,202.56 306.07,202.56 B08.B2 | v172.72,207.01 169.54,203.84 167,203.84 B19.B2 | B16.B2 204.47,202.56 200.66,202.56 199.39,201.3 193.68,201.3 192.41,202.56 B17.B2 | v231.78,205.74 231.78,205.11 230.5,203.84 B14.B2 | v247.65,200.66 247.65,201.93 247.01,202.56 247.01,203.2 245.11,205.11 243.21,203.2 B13.B2 | v288.29,214 286.38,214 284.48,212.09 284.48,208.91 282.57,207.01 282.57,205.11 281.31,203.84 B10.B2 | v134.62,206.38 132.08,203.84 128.91,203.84 B22.B2 | v139.7,201.3 140.97,202.56 B21.B2 | v87.63,213.36 87.63,212.09 82.55,207.01 82.55,205.74 80.64,203.84 78.11,203.84 B26.B2 | C32.B2 1.91,135.89 3.17,134.62 9.53,134.62 10.16,135.25 13.34,135.25 13.97,135.89 C31.B2 14.61,137.16 17.14,137.16 v20.32,140.34 | D32.B2 1.91,67.31 1.91,83.82 3.17,85.09 3.17,109.86 26.04,132.72 26.04,135.25 26.67,135.89 C30.B2 27.3,137.16 30.48,137.16 v38.73,145.41 | v70.48,138.43 69.22,137.16 65.41,137.16 C27.B2 | v97.16,138.43 92.08,138.43 90.81,137.16 C25.B2
  Top 0.508: v377.19,142.24 375.92,140.97 375.92,140.34 372.75,137.16 370.2,137.16 C03.B2 | v388.62,140.34 386.71,138.43 384.18,138.43 382.9,137.16 C02.B2 | v366.39,137.8 365.76,137.8 364.49,139.06 363.86,138.43 358.77,138.43 357.5,137.16 C04.B2 | 332.11,203.84 335.92,203.84 337.19,205.11 339.73,205.11 342.9,201.93 344.17,203.2 B05.B2 | 332.11,203.84 B06.B2 332.11,203.84 | B01.B2 394.97,203.84 393.06,203.84 392.43,204.47 391.16,204.47 388.62,207.01 386.71,205.11 384.18,205.11 382.9,203.84 B02.B2 | v363.86,207.65 361.31,205.11 360.68,205.11 359.41,203.84 357.5,203.84 B04.B2 | C19.B2 167,135.89 170.81,135.89 172.72,133.98 173.99,133.98 175.26,135.25 178.44,135.25 179.07,135.89 C18.B2 179.71,137.16 183.51,137.16 188.59,142.24 188.59,143.51 v189.23,144.15 | v147.96,138.43 142.88,138.43 141.6,137.16 C21.B2 | v160.02,139.7 159.38,139.7 158.12,138.43 155.57,138.43 154.31,137.16 C20.B2 | C17.B2 192.41,135.89 194.94,135.89 197.49,138.43 200.03,138.43 203.2,135.25 204.47,136.53 C16.B2 | C13.B2 243.21,137.16 247.01,137.16 248.28,138.43 250.19,138.43 254,134.62 255.27,135.89 C12.B2 255.91,137.16 257.18,138.43 259.71,138.43 v261.62,140.34 | v273.05,139.06 272.42,138.43 269.88,138.43 268.61,137.16 C11.B2 | v286.38,140.34 286.38,139.7 285.12,138.43 282.57,138.43 281.31,137.16 C10.B2 | v239.4,137.8 238.76,137.16 237.49,138.43 233.68,138.43 232.41,137.16 230.5,137.16 C14.B2 | 320.04,151.13 316.87,151.13 307.98,142.24 307.98,138.43 306.7,137.16 C08.B2 | 320.04,151.13 320.68,151.13 369.57,200.03 369.57,202.56 B03.B2 | 320.04,151.13 v321.94,149.22 | v125.09,137.8 124.46,137.16 123.19,138.43 121.28,138.43 120.02,137.16 116.2,137.16 C23.B2
  Top 0.508: 332.11,203.84 v332.11,207.01
  Route2 0.508: B29.B2 40.01,202.56 43.81,202.56 46.35,200.03 48.26,201.93 50.16,201.93 52.07,203.84 B28.B2 | v299.72,205.11 299.08,205.11 297.81,203.84 294,203.84 B09.B2 | B20.B2 154.31,202.56 158.12,202.56 160.66,200.03 162.56,201.93 165.74,201.93 166.37,202.56 B19.B2 | v59.69,208.28 60.33,208.28 69.22,217.17 69.22,222.89 117.47,271.14 123.19,271.14 124.46,272.41 128.27,272.41 A22.B2 | C23.B2 115.57,135.89 111.76,135.89 110.49,134.62 104.14,134.62 102.87,135.89 C24.B2 | C28.B2 52.7,135.89 56.52,135.89 59.05,133.35 60.96,135.25 64.14,135.25 64.77,135.89 C27.B2 | B04.B2 356.87,203.84 353.69,203.84 350.52,207.01 348.62,205.11 346.07,205.11 344.81,203.84 B05.B2 | B03.B2 370.2,202.56 374.01,202.56 376.56,200.03 378.46,201.93 381.63,201.93 382.27,202.56 B02.B2 | C22.B2 128.91,137.16 132.72,137.16 133.99,138.43 136.53,138.43 138.43,136.53 140.97,136.53 C21.B2 | C16.B2 205.1,135.89 208.91,135.89 211.46,133.35 213.36,135.25 216.53,135.25 217.17,135.89 C15.B2 | C09.B2 294,137.16 295.27,138.43 297.81,138.43 299.72,140.34 302.89,137.16 306.07,137.16 C08.B2 306.7,137.16 307.98,138.43 310.51,138.43 312.42,140.34 315.6,137.16 318.77,137.16 C07.B2 | v317.5,222.25 316.87,221.62 314.32,224.16 311.79,224.16 306.7,219.08 306.7,203.84 B08.B2
  Route15 0.508: B10.B2 280.67,203.84 276.86,203.84 275.59,205.11 269.88,205.11 268.61,203.84 B11.B2 | v288.29,214 293.37,208.91 293.37,203.84 B09.B2 | C29.B2 40.01,137.16 43.81,137.16 46.35,139.7 48.26,137.8 51.44,137.8 52.07,137.16 C28.B2 | C05.B2 344.81,135.89 346.07,134.62 346.07,132.72 347.98,130.81 346.07,128.91 341.63,128.91 341,129.54 341,130.18 336.55,134.62 335.28,134.62 334.01,135.89 332.11,135.89 C06.B2 331.47,137.16 331.47,139.06 330.83,139.7 330.83,140.34 v321.94,149.22 | v366.39,137.8 367.03,137.16 369.57,137.16 C03.B2
  Bottom 0.508: v146.05,288.29 148.59,288.29 162.56,274.32 165.74,274.32 | 165.74,274.32 166.37,273.69 A19.B2 | 181.61,273.69 183.51,273.69 186.06,276.22 187.96,274.32 191.13,274.32 191.77,273.69 A17.B2 192.41,273.69 193.68,274.95 199.39,274.95 200.66,273.69 204.47,273.69 A16.B2 205.1,272.41 206.38,271.14 209.55,271.14 210.82,269.88 213.36,272.41 217.17,272.41 A15.B2 | 181.61,273.69 179.71,273.69 A18.B2 | v252.73,267.97 250.82,267.97 247.65,271.14 244.47,271.14 243.21,272.41 A13.B2 | 165.74,274.32 173.35,281.94 181.61,273.69 | B32.B2 1.91,203.84 5.71,203.84 8.26,206.38 10.16,204.47 13.34,204.47 13.97,203.84 B31.B2 | v33.02,205.11 34.92,205.11 35.56,204.47 38.73,204.47 39.37,203.84 B29.B2 | v59.69,208.28 62.87,208.28 64.14,207.01 64.14,205.11 | 64.14,205.11 64.14,204.47 64.77,203.84 B27.B2 | 64.14,205.11 72.39,205.11 73.66,203.84 77.47,203.84 B26.B2 | v20.95,205.11 22.23,205.11 22.86,204.47 26.04,204.47 26.67,203.84 B30.B2 | B23.B2 116.2,203.84 120.02,203.84 122.56,206.38 124.46,204.47 127.64,204.47 128.27,203.84 B22.B2 | 102.23,205.11 102.23,204.47 102.87,203.84 B24.B2 | 102.23,205.11 102.23,207.01 99.69,209.55 v96.52,206.38 93.34,209.55 91.44,209.55 v87.63,213.36 | v109.22,205.11 102.23,205.11 | B07.B2 318.77,202.56 314.96,202.56 312.42,200.03 311.15,201.3 307.98,201.3 306.7,202.56 B08.B2 | B11.B2 267.97,203.2 266.7,204.47 263.52,201.3 260.99,201.3 259.71,202.56 255.91,202.56 B12.B2 255.27,202.56 251.46,202.56 249.56,200.66 v247.65,200.66 | B21.B2 141.6,202.56 145.41,202.56 146.69,201.3 149.22,201.3 152.4,204.47 153.67,203.2 B20.B2 | v172.72,207.01 175.26,204.47 178.44,204.47 179.07,203.84 B18.B2 179.71,203.84 180.97,205.11 186.69,205.11 187.96,203.84 191.77,203.84 B17.B2
  Bottom 0.508: B16.B2 205.1,203.84 206.38,205.11 212.09,205.11 213.36,203.84 217.17,203.84 B15.B2 217.81,202.56 219.07,201.3 222.25,201.3 223.52,200.03 226.06,202.56 229.87,202.56 B14.B2 | v231.78,205.74 232.41,205.11 237.49,205.11 238.76,203.84 242.57,203.84 B13.B2 | v139.7,201.3 v134.62,206.38 | v20.32,140.34 22.86,137.8 26.04,137.8 26.67,137.16 C30.B2 | v70.48,138.43 73.03,138.43 73.66,137.8 76.83,137.8 77.47,137.16 C26.B2 78.11,137.16 79.38,138.43 85.09,138.43 86.36,137.16 90.17,137.16 C25.B2 | v97.16,138.43 97.79,138.43 99.06,137.16 102.87,137.16 C24.B2 | v377.19,142.24 379.73,142.24 381.63,140.34 381.63,137.8 382.27,137.16 C02.B2 | v388.62,140.34 391.8,137.16 394.97,137.16 C01.B2 | C04.B2 356.87,137.16 353.06,137.16 351.79,138.43 346.07,138.43 344.81,137.16 C05.B2 | v363.86,207.65 365.12,207.65 365.76,208.28 367.67,208.28 368.94,207.01 368.94,204.47 369.57,203.84 B03.B2 | v147.96,138.43 148.59,138.43 149.86,137.16 153.67,137.16 C20.B2 | v160.02,139.7 162.56,137.16 166.37,137.16 C19.B2 | C15.B2 217.81,135.89 221.62,135.89 222.88,134.62 225.43,134.62 228.6,137.8 229.87,136.53 C14.B2 | v261.62,140.34 264.8,137.16 267.97,137.16 C11.B2 | v273.05,139.06 273.69,138.43 275.59,138.43 276.86,137.16 280.67,137.16 C10.B2 | v286.38,140.34 289.56,137.16 293.37,137.16 C09.B2 | v239.4,137.8 241.94,137.8 242.57,137.16 C13.B2 | v189.23,144.15 194.31,144.15 200.66,137.8 203.84,137.8 204.47,137.16 C16.B2 | v125.09,137.8 127.64,137.8 128.27,137.16 C22.B2 | v38.73,145.41 40.64,145.41 48.26,137.8 51.44,137.8 52.07,137.16 C28.B2 | v317.5,222.25 317.5,221.62 v332.11,207.01
-AC_CLEAR  (via drill 0.61)
  Top 0.152: v261.62,119.38 261.62,120.02 282.57,140.97 283.85,140.97 290.19,147.32 290.83,147.32 291.46,146.69 292.74,147.96 292.74,149.22 v298.45,154.94 | v279.4,171.45 279.4,172.72 295.27,188.59 295.91,188.59 297.18,189.87 297.18,191.14 v299.08,193.04
  Route2 0.152: v299.08,193.04 307.98,201.93 307.98,215.9 312.42,220.34 320.04,220.34 333.38,233.68 333.38,236.22 334.64,237.49 A06.P2
  Route15 0.152: v261.62,119.38 262.89,119.38 276.23,106.05 276.23,105.41 277.5,104.14 275.59,102.23 275.59,101.6 276.23,100.97 276.23,99.7 277.5,98.43 272.42,93.34 272.42,91.44 331.47,32.38 334.64,32.38 D06.P2 | v298.45,154.94 297.18,153.67 295.91,153.67 279.4,170.18 v279.4,171.45
-BAC0  (via drill 0.61)
  Top 0.152: v401.95,73.66 400.05,71.75 400.05,68.58 395.61,64.14 395.61,60.96 D01.D2 | v388.62,134.62 387.99,134.62 386.08,136.53 389.89,140.34 389.89,142.88 393.06,146.05 393.06,147.96 396.88,151.77 396.88,156.84 v400.05,160.02 | v393.7,177.8 393.7,179.07 398.14,183.52 398.14,184.78 400.05,186.69 400.05,189.23 398.78,190.5 v402.59,194.31 | v380.37,227.33 380.37,229.24 397.51,246.38 397.51,247.65 400.05,250.19 400.05,253.37 392.43,260.99 394.33,262.89 394.33,265.43 394.97,266.06 A01.D2
  Route2 0.152: v381,102.87 381,106.68 v396.24,121.92
  Route15 0.152: v400.05,160.02 400.05,164.47 399.42,165.1 399.42,166.37 401.32,168.28 395.61,173.99 395.61,175.26 393.7,177.16 v393.7,177.8
  Bottom 0.152: v401.95,73.66 404.5,76.2 404.5,77.47 402.59,79.38 402.59,81.28 v381,102.87 | v396.24,121.92 398.14,123.83 395.61,126.37 395.61,127 388.62,133.98 v388.62,134.62 | v402.59,194.31 405.13,196.85 396.88,205.11 396.88,206.38 390.52,212.72 390.52,217.17 v380.37,227.33
-BAC1  (via drill 0.61)
  Top 0.152: v274.32,186.06 273.05,187.33 274.32,188.59 275.59,188.59 289.56,202.56 289.56,204.47 287.65,206.38 v288.29,207.01 | v285.75,211.46 287.65,211.46 295.27,219.08 305.44,219.08 311.15,224.79 311.15,227.97 310.51,228.6 310.51,229.87 352.43,271.78 359.41,271.78 365.76,278.13 386.71,278.13 399.42,265.43 398.14,264.16 A01.E2
  Route15 0.152: v274.32,186.06 275.59,186.06 287.65,173.99 288.29,173.99 305.44,156.84 311.15,156.84 321.94,146.05 321.94,144.78 324.49,142.24 324.49,140.97 345.44,120.02 345.44,119.38 358.77,106.05 358.77,100.33 398.14,60.96 398.14,57.78 D01.E2
  Bottom 0.152: v288.29,207.01 288.29,208.91 v285.75,211.46
-BAC2  (via drill 0.61)
  Top 0.152: v386.08,166.37 387.35,167.64 387.35,170.18 386.08,171.45 391.16,176.53 396.24,176.53 396.88,177.16 396.88,181.61 398.78,183.52 398.78,184.78 403.86,189.87 v403.86,190.5
  Route2 0.152: v401.95,62.23 402.59,62.87 403.86,61.59 403.86,59.69 398.78,54.61 398.78,51.43 D01.H2 | v355.6,123.19 355.6,125.09 369.57,139.06 369.57,142.88 384.18,157.48 384.18,163.19 384.81,163.83 384.81,165.1 v386.08,166.37
  Route15 0.152: v401.95,62.23 401.95,62.87 397.51,67.31 397.51,68.58 393.06,73.03 391.16,73.03 377.82,86.36 377.82,87 374.65,90.17 374.01,90.17 368.3,95.89 368.3,96.52 367.67,97.16 367.03,97.16 365.76,98.43 365.76,99.7 358.77,106.68 358.77,118.75 358.14,119.38 358.14,120.65 v355.6,123.19 | v403.86,190.5 403.86,191.77 399.42,196.22 399.42,197.49 405.13,203.2 402.59,205.74 402.59,209.55 405.13,212.09 405.13,222.25 396.88,230.5 396.88,255.27 398.14,256.54 A01.H2
-BAC3  (via drill 0.61)
  Top 0.152: v381,27.3 384.18,27.3 398.14,41.27 398.14,43.81 D01.K2 | v310.51,98.43 307.98,100.97 307.98,102.87 317.5,112.4 321.31,112.4 321.94,113.03 323.21,113.03 323.85,113.67 v323.85,114.3 | v340.36,117.48 340.36,118.75 338.45,120.65 354.96,137.16 355.6,137.16 356.87,138.43 356.87,140.34 365.12,148.59 365.76,148.59 367.03,149.86 367.03,153.03 371.48,157.48 371.48,163.19 v394.97,186.69 | v377.19,208.91 377.19,213.36 v399.42,235.59
  Route15 0.152: v358.14,50.16 346.07,62.23 346.07,62.87 344.81,64.14 343.54,64.14 311.15,96.52 311.15,97.79 v310.51,98.43
  Bottom 0.152: v358.14,50.16 v381,27.3 | v323.85,114.3 323.85,116.84 323.21,117.48 323.21,119.38 324.49,120.65 317.5,127.64 318.77,128.91 320.68,127 320.68,126.37 321.31,125.73 324.49,125.73 328.93,130.18 335.28,123.83 335.28,123.19 340.36,118.11 v340.36,117.48 | v394.97,186.69 394.97,187.96 377.19,205.74 v377.19,208.91 | v399.42,235.59 405.13,241.3 399.42,247.02 399.42,249.56 398.78,250.19 A01.K2
-BAC4  (via drill 0.61)
  Top 0.152: v323.21,124.46 321.94,124.46 319.4,121.92 v318.77,121.92
  Route2 0.152: v244.47,196.85 244.47,202.56 247.65,205.74 247.65,208.91 256.54,217.81 256.54,218.44 257.81,219.71 261.62,219.71 262.25,220.34 268.61,220.34 269.88,221.62 269.88,226.69 279.4,236.22 285.75,236.22 302.26,252.73 308.61,252.73 314.96,259.08 321.31,259.08 327.66,265.43 334.01,265.43 340.36,271.78 348.62,271.78 354.33,266.06 356.24,267.97 358.77,267.97 367.03,259.71 368.94,261.62 371.48,261.62 392.43,240.66 394.33,242.57 396.88,242.57 398.14,243.84 A01.M2
  Route15 0.152: v344.17,102.87 349.25,102.87 352.43,99.7 352.43,99.06 354.33,97.16 354.96,97.16 379.1,73.03 381,73.03 384.18,69.85 384.18,68.58 398.14,54.61 396.24,52.7 396.24,48.89 396.88,48.26 396.88,43.81 398.14,42.55 398.14,38.73 D01.M2 | v307.34,132.08 307.34,132.72 296.55,143.51 294,143.51 287.02,150.5 286.38,150.5 269.88,167 269.88,172.09 269.24,172.72 263.52,172.72 262.89,173.36 262.25,173.36 260.99,174.62 260.99,175.9 257.81,179.07 257.81,179.71 253.37,184.15 252.73,184.15 244.47,192.41 v244.47,196.85
  Bottom 0.152: v344.17,102.87 343.54,102.87 323.21,123.19 v323.21,124.46 | v318.77,121.92 317.5,121.92 v307.34,132.08
-BAC5  (via drill 0.61)
  Top 0.152: v375.92,205.11 372.11,205.11 370.84,206.38 373.38,208.91 374.01,208.91 375.29,210.19 375.29,212.09 396.88,233.68 396.88,236.22 398.14,237.49 A01.P2
  Route2 0.152: v402.59,51.43 396.88,45.72 396.88,40.64 394.97,38.73 398.14,35.56 398.14,32.38 D01.P2 | v360.05,112.4 361.31,112.4 365.76,116.84 365.76,118.75 363.86,120.65 368.3,125.09 368.94,125.09 374.65,130.81 374.65,131.44 391.16,147.96 391.16,149.86 392.43,151.13 392.43,152.4 397.51,157.48 397.51,158.75 400.05,161.29 400.05,163.83 398.14,165.74 400.05,167.64 400.05,170.81 399.42,171.45 400.05,172.09 400.05,173.36 403.86,177.16 v403.86,177.8
  Route15 0.152: v371.48,95.89 371.48,100.33 367.03,104.78 366.39,104.78 360.05,111.12 v360.05,112.4 | v382.9,198.75 382.9,199.39 377.19,205.11 v375.92,205.11
  Bottom 0.152: v402.59,51.43 404.5,53.34 403.23,54.61 403.23,55.24 370.84,87.63 370.84,90.81 372.11,92.08 370.84,93.34 370.84,95.25 v371.48,95.89 | v403.86,177.8 403.86,178.44 396.88,185.42 394.97,185.42 393.7,186.69 394.33,187.33 393.7,187.96 393.7,188.59 383.54,198.75 v382.9,198.75
-BAC6  (via drill 0.61)
  Top 0.152: v364.49,63.5 364.49,64.14 373.38,73.03 v374.01,73.03 | v333.38,110.49 334.01,109.86 342.9,118.75 344.17,118.75 346.07,120.65 346.07,121.29 347.98,123.19 347.98,124.46 357.5,133.98 v357.5,134.62
  Route2 0.152: v357.5,134.62 361.95,139.06 361.95,147.96 371.48,157.48 371.48,163.19 393.7,185.42 394.97,185.42 396.88,187.33 396.88,187.96 397.51,188.59 397.51,190.5 400.05,193.04 400.05,196.22 398.78,197.49 403.86,202.56 403.86,204.47 400.69,207.65 404.5,211.46 404.5,222.89 397.51,229.87 398.78,231.14 A01.S2
  Route15 0.152: v353.69,87 353.06,87 333.38,106.68 v333.38,110.49
  Bottom 0.152: v364.49,63.5 364.49,62.87 372.11,55.24 372.11,54.61 398.14,28.58 398.14,26.04 D01.S2 | v374.01,73.03 373.38,73.03 370.2,76.2 370.2,77.47 365.12,82.55 358.14,82.55 v353.69,87
-BAC7  (via drill 0.61)
  Top 0.152: v367.03,13.97 377.19,13.97 381,17.78 387.35,17.78 391.16,21.59 394.97,21.59 D01.T2 | v346.07,196.85 347.98,196.85 349.88,198.75 351.79,198.75 353.69,196.85 361.31,204.47 361.95,204.47 365.76,208.28 367.67,208.28 377.19,217.81 377.19,219.71 382.27,224.79 382.27,226.06 387.35,231.14 v387.35,231.78
  Route2 0.152: v282.57,95.89 282.57,96.52 289.56,103.51 294.64,103.51 295.27,104.14 295.27,109.86 320.04,134.62 320.68,134.62 335.92,149.86 339.09,149.86 358.77,169.55 364.49,169.55 367.03,172.09 v367.03,172.72
  Route15 0.152: v367.03,13.97 362.58,13.97 320.68,55.88 320.68,61.59 320.04,62.23 320.04,62.87 308.61,74.3 306.07,74.3 300.99,79.38 300.99,80.01 298.45,82.55 294,82.55 282.57,93.98 v282.57,95.89
  Bottom 0.152: v367.03,172.72 365.76,172.72 346.07,192.41 v346.07,196.85 | v387.35,231.78 387.35,229.87 386.08,228.6 391.16,223.52 393.06,223.52 396.24,226.69 394.97,227.97 A01.T2
-BAC8  (via drill 0.61)
  Top 0.152: v356.24,90.17 357.5,90.17 361.95,94.62 v361.95,95.25 | v360.05,141.61 360.68,141.61 363.22,144.15 365.12,144.15 v405.13,184.15 | v394.97,205.11 394.97,211.46 389.89,216.53 394.97,221.62 A01.V2
  Route2 0.152: v342.9,117.48 342.9,120.02 344.17,121.29 344.81,121.29 346.07,122.56 346.07,128.27 354.96,137.16 355.6,137.16 v360.05,141.61
  Route15 0.152: v354.96,82.55 356.24,83.82 355.6,84.46 355.6,88.27 356.87,89.54 v356.24,90.17
  Bottom 0.152: v354.96,82.55 358.14,79.38 358.14,76.2 364.49,69.85 364.49,69.22 365.76,67.95 366.39,67.95 369.57,64.77 374.65,64.77 396.88,42.55 396.88,30.48 405.13,22.23 399.42,16.51 395.61,16.51 D01.V2 | v361.95,95.25 361.95,96.52 349.88,108.59 349.25,108.59 347.98,109.86 347.98,111.12 342.9,116.21 v342.9,117.48 | v405.13,184.15 396.88,192.41 396.88,196.22 400.69,200.03 395.61,205.11 v394.97,205.11
-BAC9  (via drill 0.61)
  Top 0.152: v371.48,73.03 372.11,73.03 384.18,85.09 v384.18,88.9 | v389.25,102.87 v381.63,95.25 | v368.94,127 370.2,127 381,137.8 381,139.06 v389.89,147.96 | v385.44,184.15 394.33,193.04 394.33,193.68 395.61,194.94 396.88,194.94 v398.14,196.22
  Route2 0.152: v389.89,147.96 389.25,148.59 391.8,151.13 391.8,152.4 396.24,156.84 396.24,157.48 396.88,158.12 v396.88,167.64
  Route15 0.152: v398.14,196.22 398.14,197.49 401.32,200.66 374.01,227.97 374.01,229.24 379.73,234.95 371.48,243.21 371.48,252.73 383.54,264.8 382.27,266.06 A02.D2
  Bottom 0.152: v371.48,73.03 373.38,71.12 374.65,71.12 382.27,63.5 382.27,60.96 D02.D2 | v384.18,88.9 384.18,92.71 v381.63,95.25 | v389.25,102.87 389.89,102.87 391.8,104.78 384.18,112.4 378.46,112.4 371.48,119.38 371.48,124.46 v368.94,127 | v396.88,167.64 396.88,172.72 v385.44,184.15
-BAC10  (via drill 0.61)
  Top 0.152: v393.06,150.5 393.06,153.67 396.88,157.48 396.88,163.19 v405.13,171.45 | v368.94,212.72 368.94,218.44 396.88,246.38 396.88,255.27 387.35,264.8 386.08,263.52 A02.E2
  Route2 0.152: v391.16,66.04 386.08,60.96 386.08,57.78 D02.E2 | v358.77,95.25 358.77,96.52 369.57,107.32 369.57,108.59 374.65,113.67 374.65,116.84 373.38,118.11 397.51,142.24 v397.51,142.88
  Route15 0.152: v391.16,66.04 391.16,67.31 375.29,83.19 370.2,83.19 366.39,87 365.76,87 358.77,93.98 v358.77,95.25 | v383.54,193.04 371.48,205.11 371.48,210.19 v368.94,212.72
  Bottom 0.152: v397.51,142.88 397.51,146.05 v393.06,150.5 | v405.13,171.45 v383.54,193.04
-BAC11  (via drill 0.61)
  Top 0.152: v391.8,76.2 391.16,75.57 396.88,69.85 396.88,66.04 394.97,64.14 394.97,62.87 386.08,53.98 386.08,51.43 D02.H2 | v316.87,218.44 314.32,220.98 318.13,224.79 318.13,226.69 313.06,231.78 346.07,264.8 352.43,264.8 358.77,271.14 365.12,271.14 365.76,271.78 374.01,271.78 382.9,262.89 381,260.99 381,259.71 384.18,256.54 385.44,257.81 A02.H2
  Route2 0.152: v320.68,197.49 320.68,201.3 v325.75,206.38
  Route15 0.152: v391.8,76.2 391.8,84.46 396.24,88.9 v396.88,88.9 | v393.06,97.16 381,109.22 381,109.86 371.48,119.38 371.48,122.56 382.27,133.35 375.29,140.34 375.29,141.61 v370.2,146.69
  Bottom 0.152: v396.88,88.9 396.88,92.71 393.7,95.89 393.7,96.52 v393.06,97.16 | v370.2,146.69 370.2,148.59 321.31,197.49 v320.68,197.49 | v325.75,206.38 325.75,208.28 321.94,212.09 321.94,213.36 v316.87,218.44
-BMB0  (via drill 0.61)
  Route2 0.152: v325.12,100.33 325.12,101.6 327.66,104.14 327.66,106.05 325.75,107.95 337.19,119.38 v337.82,119.38 | v273.05,180.97 273.05,182.88 271.14,184.78 273.05,186.69 273.05,187.33 274.32,188.59 275.59,188.59 282.57,195.58 282.57,196.85 v283.85,198.12 | v261.62,230.5 261.62,231.78 271.14,241.3 277.5,234.95 314.32,271.78 321.31,271.78 327.66,278.13 339.73,278.13 340.36,278.76 354.96,278.76 368.3,265.43 369.57,266.7 A03.D2
  Route15 0.152: v325.12,100.33 326.39,100.33 339.73,87 339.73,86.36 343.54,82.55 349.25,82.55 354.96,76.84 354.96,74.93 358.14,71.75 358.14,68.58 363.22,63.5 365.12,65.41 368.94,65.41 370.2,64.14 370.2,60.96 D03.D2 | v337.82,119.38 337.82,121.29 320.68,138.43 320.68,139.7 315.6,144.78 315.6,146.05 295.27,166.37 288.93,166.37 275.59,179.71 274.32,179.71 v273.05,180.97
  Bottom 0.152: v283.85,198.12 282.57,199.39 282.57,206.38 276.23,212.72 276.23,217.17 262.89,230.5 v261.62,230.5
-BMB1  (via drill 0.61)
  Top 0.152: v282.57,146.69 282.57,150.5 292.1,160.02 297.81,160.02 v305.44,167.64 | v320.68,187.33 320.68,187.96 321.31,188.59 v325.75,188.59 | v371.48,259.71 371.48,260.99 373.38,262.89 A03.E2
  Route2 0.152: v305.44,167.64 305.44,168.28 307.98,170.81 307.98,176.53 316.87,185.42 318.77,185.42 v320.68,187.33 | v325.75,188.59 326.39,188.59 333.38,195.58 333.38,201.3 v339.09,207.01 | v325.75,220.34 324.49,220.34 322.58,222.25 340.36,240.03 346.71,240.03 353.06,246.38 358.77,246.38 371.48,259.08 v371.48,259.71
  Route15 0.152: v282.57,146.69 288.29,140.97 288.29,139.06 320.68,106.68 320.68,100.33 341.63,79.38 341.63,78.11 342.26,77.47 342.26,76.84 347.98,71.12 349.25,71.12 358.14,62.23 364.49,62.23 368.94,57.78 372.75,57.78 D03.E2
  Bottom 0.152: v339.09,207.01 v325.75,220.34
-BMB2  (via drill 0.61)
  Top 0.152: v392.43,141.61 392.43,144.78 393.7,146.05 393.7,147.32 v404.5,158.12
  Route2 0.152: v403.23,128.91 401.32,127 403.86,124.46 403.86,123.19 398.78,118.11 400.05,116.84 400.05,113.67 398.14,111.76 400.05,109.86 400.05,107.32 397.51,104.78 397.51,103.51 382.9,88.9 384.18,87.63 384.18,85.09 381.63,82.55 386.08,78.11 386.08,75.57 384.81,74.3 384.81,71.75 384.18,71.12 384.18,65.41 373.38,54.61 373.38,51.43 D03.H2 | v393.7,169.55 393.7,173.36 403.86,183.52 v403.86,184.15 | v358.77,233.05 358.14,233.68 358.77,234.31 358.77,240.03 371.48,252.73 371.48,255.27 372.75,256.54 A03.H2
  Bottom 0.152: v403.23,128.91 404.5,130.18 401.95,132.72 401.32,132.72 393.7,140.34 393.7,140.97 393.06,141.61 v392.43,141.61 | v404.5,158.12 404.5,158.75 v393.7,169.55 | v403.86,184.15 403.86,184.78 396.24,192.41 395.61,192.41 393.7,194.31 393.7,194.94 361.95,226.69 361.95,227.97 358.77,231.14 v358.77,233.05
-BMB3  (via drill 0.61)
  Top 0.152: v401.32,58.42 397.51,58.42 394.33,55.24 393.7,55.24 377.19,38.73 373.38,38.73 D03.M2 | v395.61,109.22 400.05,113.67 400.05,114.94 v398.78,116.21 | v396.88,184.15 396.88,187.96 397.51,188.59 397.51,190.5 400.05,193.04 400.05,196.22 398.78,197.49 403.86,202.56 403.86,204.47 400.05,208.28 v403.23,211.46
  Route2 0.152: v374.01,91.44 374.01,92.71 384.18,102.87 387.99,102.87 389.25,101.6 393.7,106.05 393.7,107.32 v395.61,109.22 | v387.35,146.69 387.35,147.32 391.16,151.13 391.16,153.03 386.08,158.12 387.35,159.39 387.35,164.47 386.71,165.1 387.35,165.74 387.35,166.37 390.52,169.55 390.52,170.81 391.16,171.45 391.16,172.09 388.62,174.62 396.88,182.88 v396.88,184.15
  Route15 0.152: v403.23,211.46 403.23,217.81 394.97,226.06 394.97,226.69 393.7,227.97 392.43,227.97 377.19,243.21 374.01,243.21 373.38,243.84 A03.M2
  Bottom 0.152: v401.32,58.42 400.69,58.42 389.89,69.22 389.89,74.3 378.46,85.73 378.46,87 v374.01,91.44 | v398.78,116.21 398.78,118.75 400.69,120.65 399.42,121.92 397.51,121.92 396.24,120.65 393.7,123.19 393.7,125.73 394.97,127 387.35,134.62 387.35,135.89 386.71,136.53 386.71,138.43 387.99,139.7 387.35,140.34 v387.35,146.69
-BMB4  (via drill 0.61)
  Top 0.152: v319.4,102.87 320.04,102.87 v355.6,138.43 | v307.98,189.23 307.98,195.58 327.02,214.63 327.02,215.27 334.64,222.89 v334.64,223.52 | v351.15,220.34 352.43,220.34 365.76,233.68 370.84,233.68 371.48,234.31 373.38,232.41 A03.S2
  Route2 0.152: v334.64,223.52 334.64,220.34 341,214 346.07,219.08 349.88,219.08 v351.15,220.34
  Route15 0.152: v363.86,36.83 363.86,38.73 372.75,47.62 358.77,61.59 353.06,61.59 346.07,68.58 346.07,72.39 341,77.47 341,79.38 320.04,100.33 320.04,102.23 v319.4,102.87
  Bottom 0.152: v363.86,36.83 364.49,36.83 372.75,28.58 372.75,26.04 D03.S2 | v355.6,138.43 356.87,139.7 354.96,141.61 352.43,141.61 339.09,154.94 339.09,155.58 337.82,156.84 337.19,156.84 307.98,186.06 v307.98,189.23
-BMB5  (via drill 0.61)
  Route2 0.152: v382.9,120.02 382.9,121.29 396.88,135.25 396.88,140.97 398.78,142.88 398.78,153.03 403.23,157.48 403.23,158.12 v405.13,160.02
  Route15 0.152: v405.13,80.65 405.13,74.3 399.42,68.58 399.42,66.04 403.86,61.59 403.86,60.32 404.5,59.69 396.88,52.07 396.88,48.89 404.5,41.27 400.05,36.83 397.51,36.83 395.61,38.73 373.38,16.51 370.2,16.51 D03.V2 | v393.7,98.43 393.7,100.97 394.97,102.23 381,116.21 381,118.11 v382.9,120.02 | v400.05,174.62 400.05,177.16 396.88,180.34 396.88,182.25 401.95,187.33 396.88,192.41 396.88,199.39 391.8,204.47 390.52,204.47 375.92,219.08 372.11,219.08 369.57,221.62 A03.V2
  Bottom 0.152: v405.13,80.65 405.13,85.09 396.24,93.98 396.24,95.25 393.7,97.79 v393.7,98.43 | v405.13,160.02 403.86,160.02 399.42,164.47 399.42,167 401.32,168.91 399.42,170.81 399.42,171.45 400.05,172.09 v400.05,174.62
-BMB6  (via drill 0.61)
  Top 0.152: v323.85,88.9 323.85,88.27 320.04,84.46 314.96,84.46 313.69,83.19 310.51,83.19 309.88,82.55 v307.98,82.55 | v249.56,144.15 250.19,144.15 280.04,173.99 280.04,175.26 278.13,177.16 281.94,180.97 v282.57,180.97
  Route2 0.152: v273.05,195.58 271.78,196.85 276.86,201.93 281.94,201.93 285.75,205.74 285.75,210.19 289.56,214 289.56,215.27 302.26,227.97 303.53,227.97 306.7,231.14 306.7,233.05 313.06,239.4 314.32,239.4 314.96,240.03 321.31,240.03 327.66,246.38 335.92,246.38 337.82,244.47 352.43,259.08 353.69,259.08 356.24,261.62 358.77,261.62 360.05,262.89 A04.E2
  Route15 0.152: v323.85,88.9 324.49,88.27 323.21,87 323.21,85.09 326.39,81.92 328.93,81.92 339.09,71.75 342.26,71.75 356.87,57.15 360.05,57.15 D04.E2 | v307.98,82.55 299.08,82.55 298.45,83.19 294,83.19 292.1,85.09 292.1,87.63 293.37,88.9 291.46,90.81 290.83,90.81 288.93,92.71 288.93,93.34 286.38,95.89 285.75,95.89 284.48,97.16 284.48,99.06 279.4,104.14 279.4,104.78 278.13,106.05 276.86,106.05 266.7,116.21 266.7,120.02 267.97,121.29 250.19,139.06 250.19,143.51 v249.56,144.15
  Bottom 0.152: v282.57,180.97 282.57,186.06 v273.05,195.58
-BMB7  (via drill 0.61)
  Top 0.152: v371.48,59.69 368.3,56.52 368.3,55.24 360.68,47.62 360.68,45.09 D04.K2
  Route2 0.152: v371.48,59.69 376.56,64.77 377.19,64.77 381.63,69.22 381.63,71.12 382.27,71.75 382.27,73.03 v384.81,75.57 | v372.11,93.34 369.57,95.89 375.92,102.23 v375.92,102.87 | v298.45,198.75 305.44,205.74 305.44,219.08 307.98,221.62 307.98,226.69 320.68,239.4 327.02,239.4 327.66,240.03 334.01,240.03 340.36,246.38 346.71,246.38 353.06,252.73 358.77,252.73 360.05,251.46 A04.K2
  Route15 0.152: v375.92,102.87 375.29,102.87 371.48,106.68 371.48,111.12 372.75,112.4 368.3,116.84 368.3,117.48 367.03,118.75 365.76,118.75 346.07,138.43 346.07,143.51 v344.81,144.78 | v336.55,155.58 336.55,157.48 323.21,170.81 323.21,173.36 324.49,174.62 323.21,175.9 318.13,175.9 297.81,196.22 297.81,198.12 v298.45,198.75
  Bottom 0.152: v384.81,75.57 383.54,75.57 371.48,87.63 371.48,90.17 373.38,92.08 v372.11,93.34 | v344.81,144.78 344.81,148.59 339.09,154.31 337.82,154.31 v336.55,155.58
-BMB8  (via drill 0.61)
  Top 0.152: v368.3,130.18 367.03,130.18 364.49,127.64 364.49,125.73 369.57,120.65 381.63,132.72 381.63,135.25 380.37,136.53 391.16,147.32 391.16,150.5 391.8,151.13 391.8,153.03 389.25,155.58 394.33,160.66 v394.97,160.66 | v356.24,232.41 356.87,232.41 358.77,234.31 358.77,236.22 360.05,237.49 A04.P2
  Route2 0.152: v337.82,90.17 337.19,90.17 335.28,92.08 355.6,112.4 355.6,113.67 358.77,116.84 358.77,121.92 365.76,128.91 367.03,128.91 v368.3,130.18 | v394.97,160.66 394.33,161.29 394.33,163.83 392.43,165.74 396.88,170.18 v396.88,174.62
  Route15 0.152: v374.01,46.35 375.92,44.45 363.86,32.38 360.68,32.38 D04.P2 | v396.88,174.62 396.88,179.71 386.71,189.87 386.71,191.77 391.8,196.85 v356.24,232.41
  Bottom 0.152: v374.01,46.35 374.01,47.62 371.48,50.16 371.48,55.24 360.05,66.67 360.05,67.95 358.77,69.22 358.77,71.12 354.96,74.93 354.96,76.84 349.25,82.55 345.44,82.55 342.9,85.09 342.9,85.73 341.63,87 340.36,87 337.82,89.54 v337.82,90.17
-BMB9  (via drill 0.61)
  Top 0.152: v323.85,56.52 324.49,56.52 336.55,68.58 336.55,69.85 v339.73,73.03 | v216.53,213.36 217.81,213.36 263.52,259.08 264.8,259.08 267.33,261.62 273.05,261.62 282.57,271.14 288.93,271.14 289.56,271.78 294.64,271.78 v300.99,278.13
  Route15 0.152: v323.85,56.52 324.49,55.88 326.39,55.88 356.24,26.04 360.05,26.04 D04.S2 | v339.73,73.03 342.26,75.57 340.36,77.47 340.36,79.38 332.74,87 327.66,87 297.81,116.84 297.81,119.38 299.08,120.65 294.64,125.09 294,125.09 292.74,126.37 292.74,127.64 287.02,133.35 286.38,133.35 285.12,134.62 285.12,136.53 282.57,139.06 282.57,141.61 271.78,152.4 271.78,153.03 269.88,154.94 269.88,160.02 v216.53,213.36 | v300.99,278.13 304.8,278.13 314.96,267.97 320.68,267.97 352.43,236.22 353.69,236.22 358.14,231.78 360.05,231.78 A04.S2
-BMB10  (via drill 0.61)
  Top 0.152: v400.05,50.16 398.78,48.89 393.7,48.89 360.68,15.88 357.5,19.05 357.5,21.59 D04.T2 | v381,71.75 382.27,71.75 383.54,73.03 384.81,73.03 401.32,89.54 v401.32,90.17 | v374.65,168.28 375.92,168.28 392.43,184.78 v392.43,185.42 | v389.89,257.81 389.25,257.81 361.95,230.5 360.05,230.5 357.5,227.97 A04.T2
  Route2 0.152: v396.88,99.06 396.88,102.23 398.14,103.51 398.14,104.78 403.86,110.49 403.86,112.4 v401.32,114.94 | v392.43,185.42 391.16,185.42 386.08,190.5 394.97,199.39 394.97,200.66 400.05,205.74 400.05,209.55 403.23,212.72 403.23,217.81 394.97,226.06 396.88,227.97 396.88,239.4 400.69,243.21 400.69,245.75 389.25,257.18 v389.89,257.81
  Route15 0.152: v401.32,114.94 393.7,122.56 393.7,125.09 398.14,129.54 393.7,133.98 393.7,139.06 395.61,140.97 388.62,147.96 388.62,149.22 377.19,160.66 376.56,160.66 375.29,161.93 375.29,163.19 374.01,164.47 374.01,166.37 375.29,167.64 v374.65,168.28
  Bottom 0.152: v400.05,50.16 400.05,52.07 383.54,68.58 382.9,68.58 381.63,69.85 381.63,71.12 v381,71.75 | v401.32,90.17 400.69,90.17 396.88,93.98 v396.88,99.06
-BMB11  (via drill 0.61)
  Top 0.152: v219.71,150.5 222.25,153.03 222.25,153.67 292.1,223.52 293.37,223.52 v295.27,225.43
  Route2 0.152: v317.5,209.55 318.13,209.55 329.56,220.98 329.56,222.89 333.38,226.69 339.73,226.69 340.36,227.33 349.25,227.33 355.6,220.98 356.87,222.25 A04.V2
  Route15 0.152: v240.03,117.48 244.47,113.03 244.47,106.68 251.46,99.7 251.46,98.43 252.73,97.16 253.37,97.16 346.07,4.45 356.87,15.24 D04.V2 | v295.27,225.43 295.27,224.16 299.08,220.34 300.36,220.34 311.15,209.55 v317.5,209.55
  Bottom 0.152: v240.03,117.48 231.78,125.73 231.78,137.8 219.71,149.86 v219.71,150.5
-BRK_IN_PRG  (via drill 0.61)
  Top 0.152: v393.7,221.62 381.63,209.55 381.63,205.74 375.92,200.03 381,194.94 381,194.31 384.18,191.14 384.18,189.87 383.54,189.23 378.46,189.23 370.2,180.97 370.2,178.44 B03.L2 | v268.61,289.56 266.06,289.56 264.8,290.83 263.52,289.56 256.54,289.56 255.91,290.19 252.73,290.19 250.82,288.29 244.47,288.29 v238.76,282.57
  Route2 0.152: v205.74,290.19 198.12,282.57 197.49,282.57 195.58,280.67 190.5,280.67 170.81,260.99 170.81,258.44 170.18,257.81 A19.H2